# EAGLE design untitled2-6 (EAGLE 9.6.2)
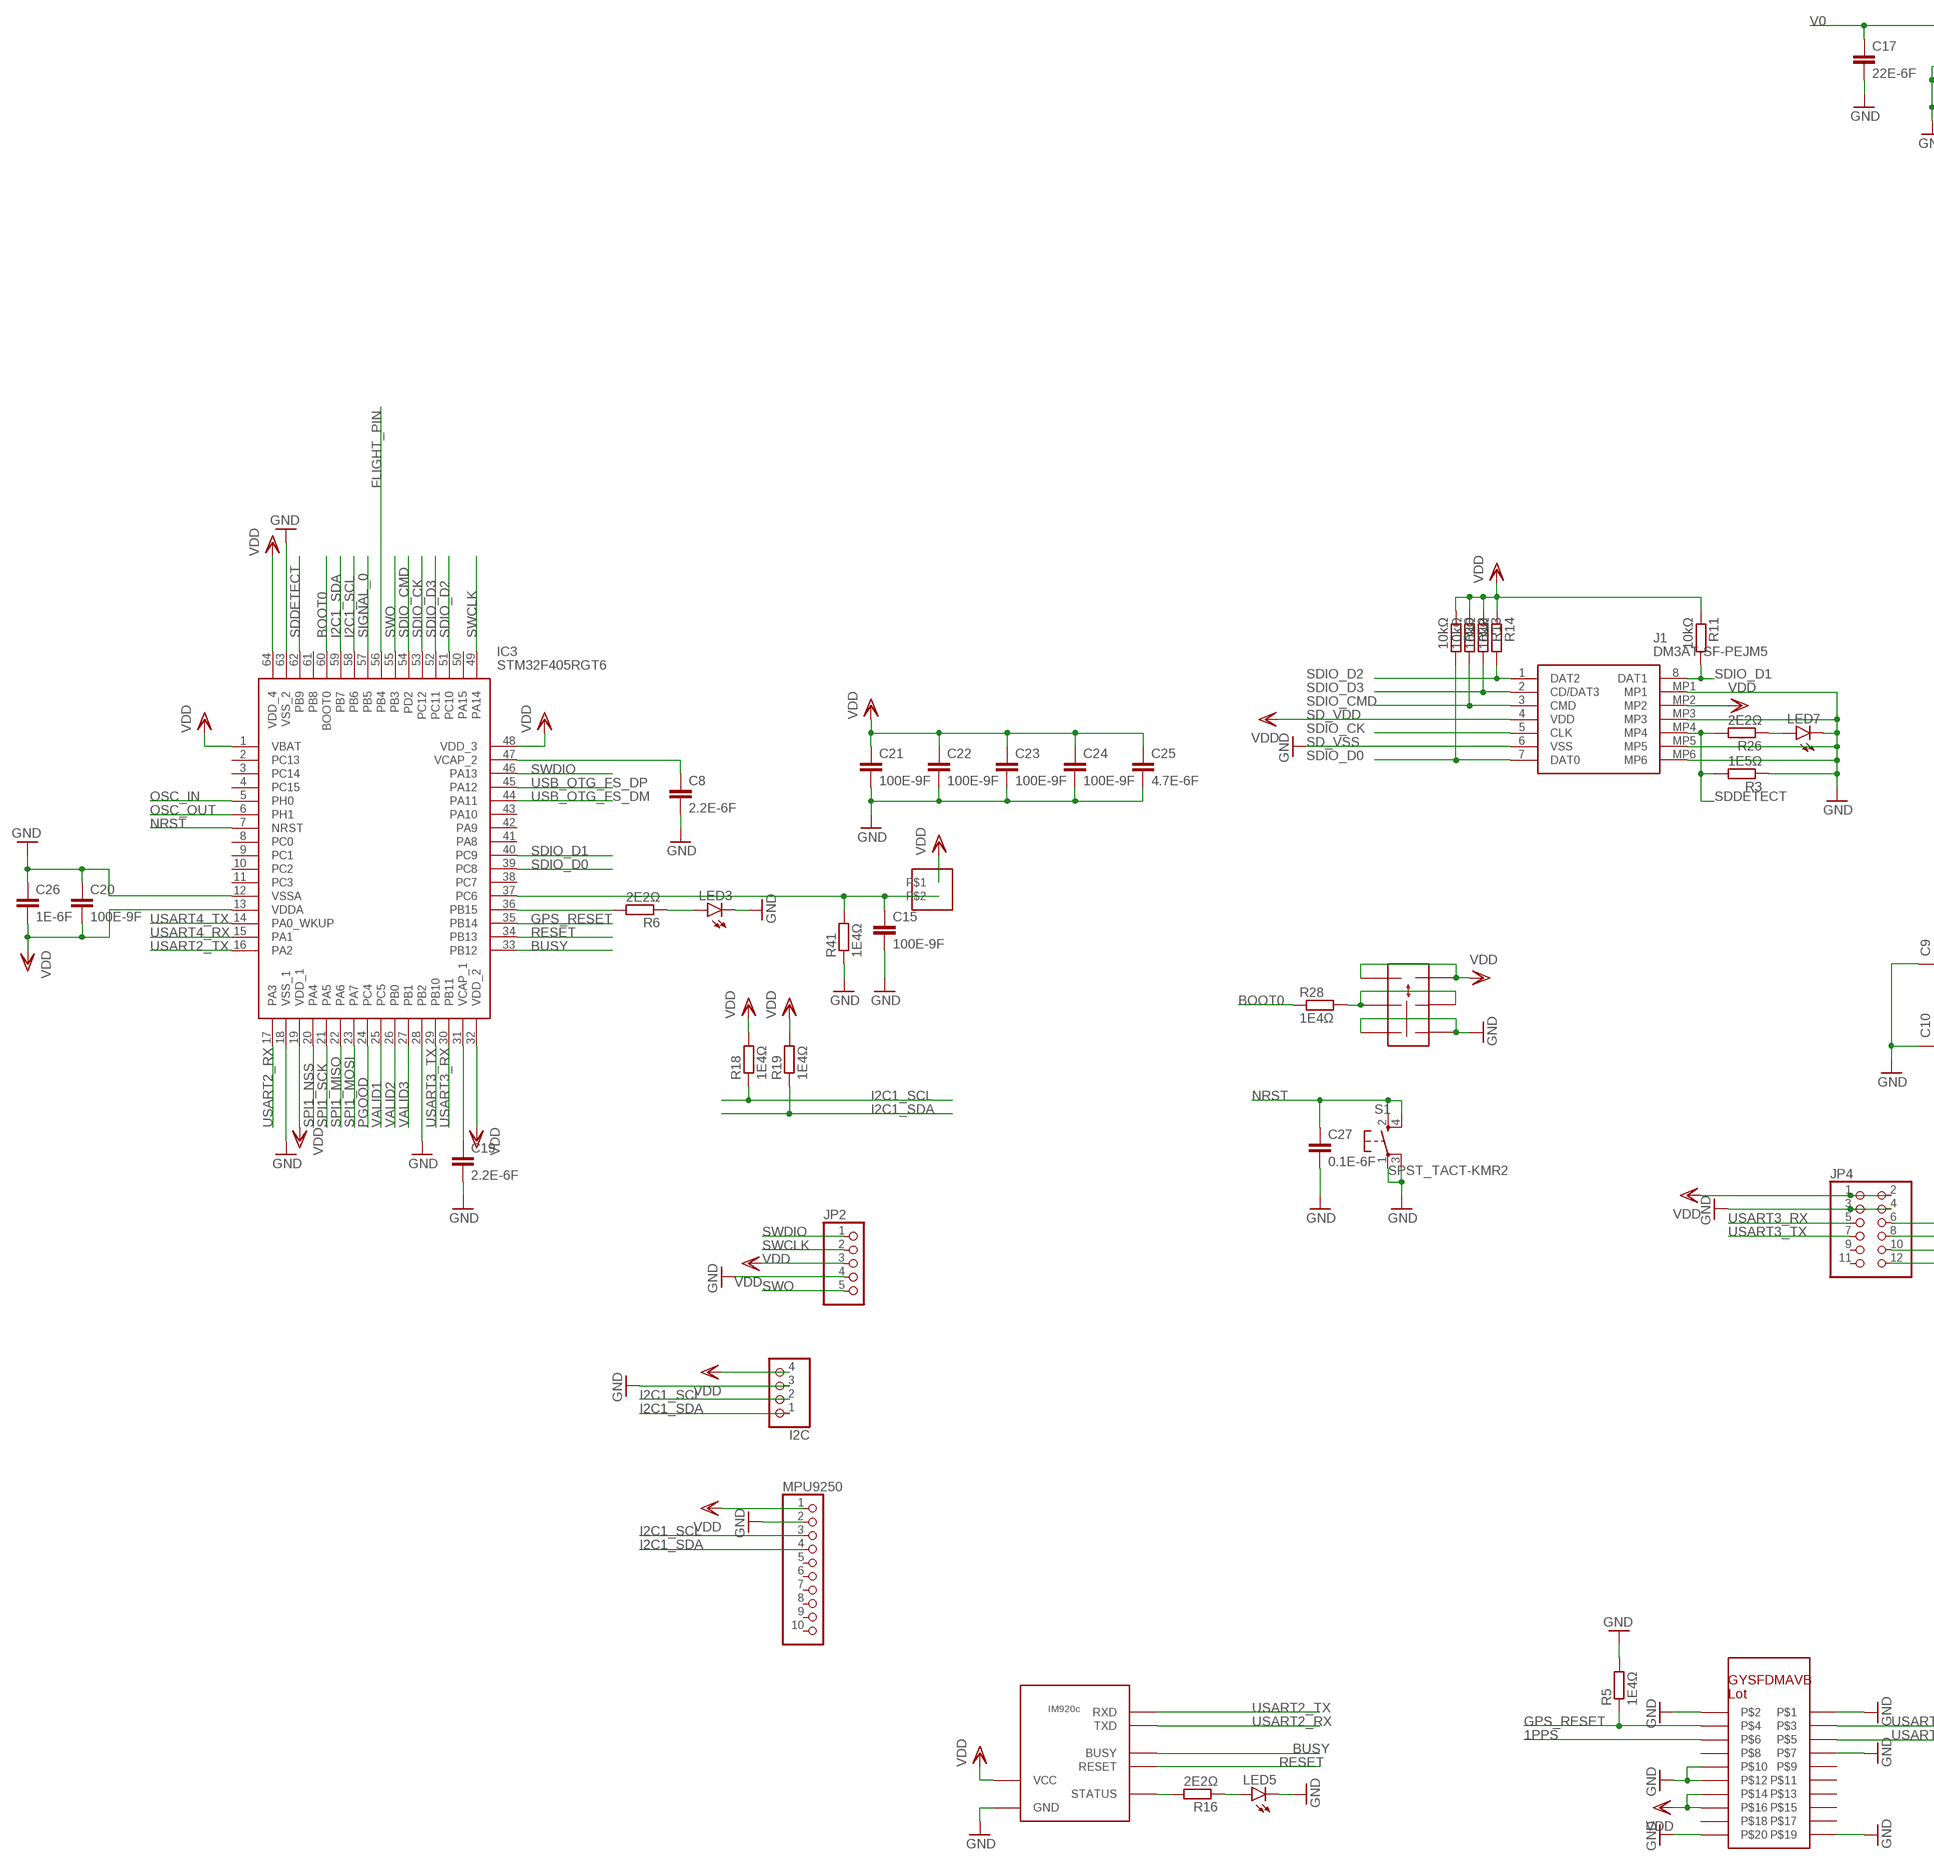
[diagram p0: schematic, sheet 1, part 1 of 2]
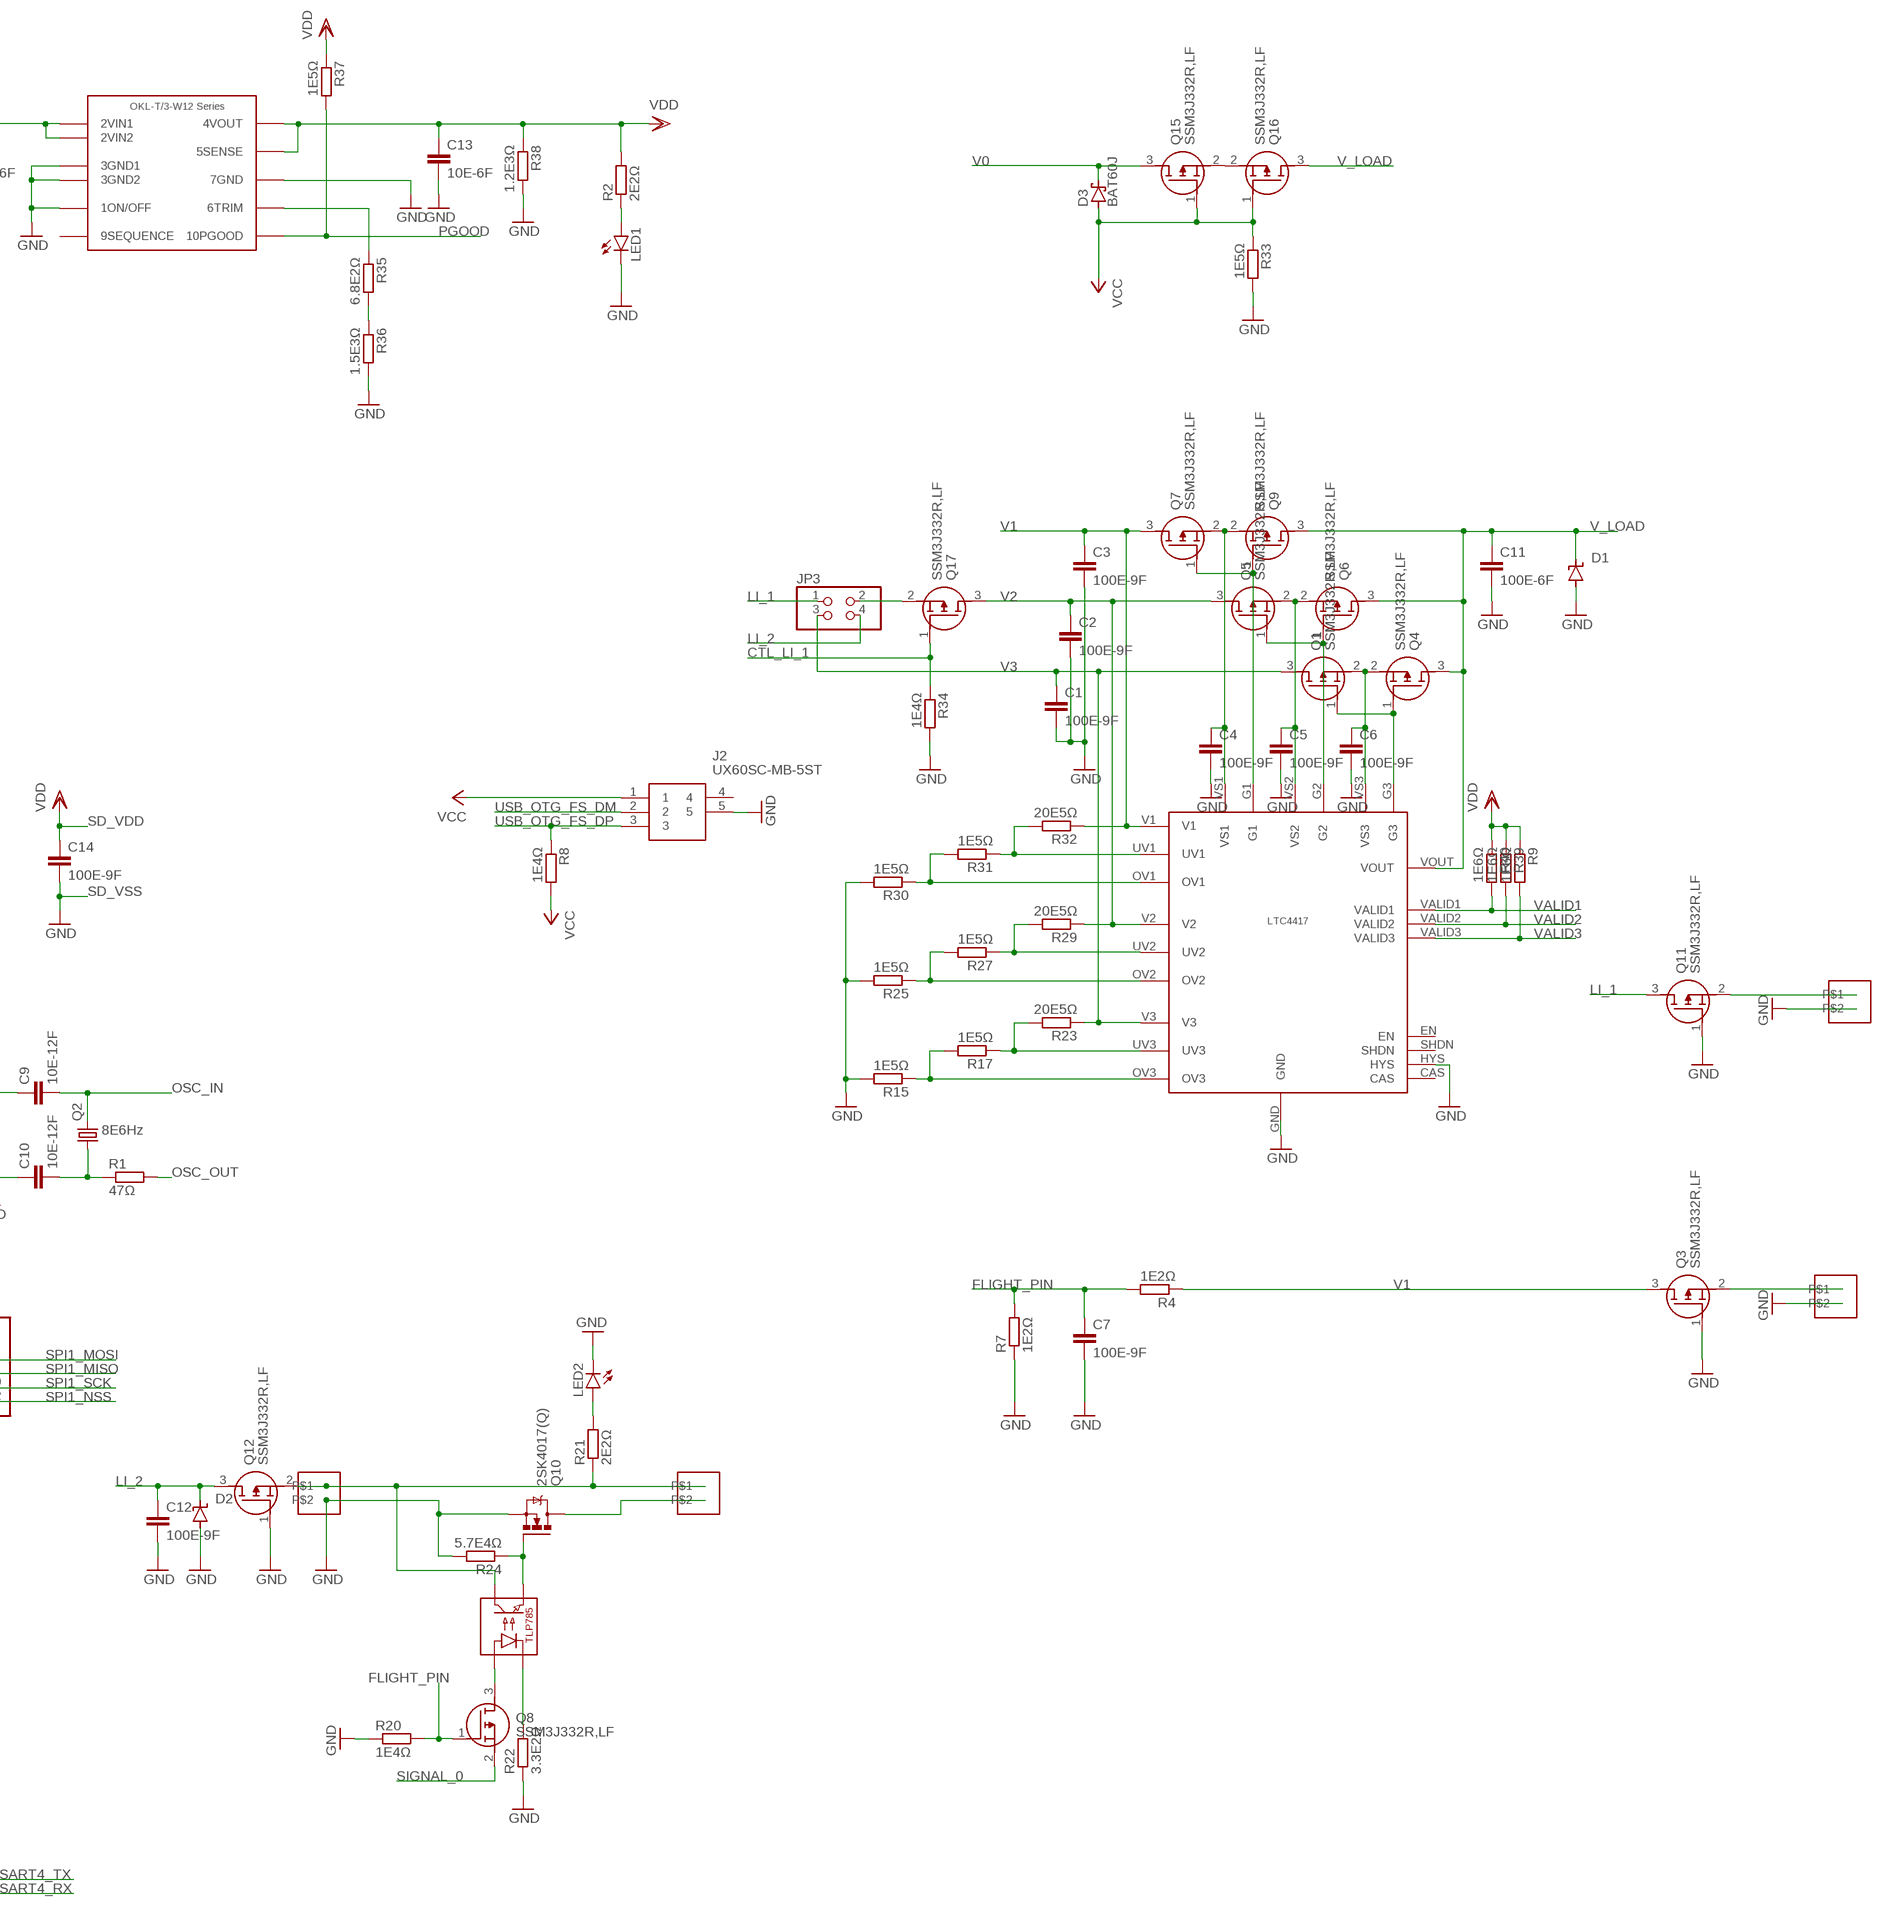
[diagram p1: schematic, sheet 1, part 2 of 2]

## Parts
C1  100E-9F  C-EUC0805  [C0805]
C2  100E-9F  C-EUC0805  [C0805]
C3  100E-9F  C-EUC0805  [C0805]
C4  100E-9F  C-EUC0805  [C0805]
C5  100E-9F  C-EUC0805  [C0805]
C6  100E-9F  C-EUC0805  [C0805]
C7  100E-9F  C-EUC0805  [C0805]
C8  2.2E-6F  C-EUC0805  [C0805]
C9  10E-12F  C-EUC0805  [C0805]
C10  10E-12F  C-EUC0805  [C0805]
C11  100E-6F  C-EUC0805  [C0805]
C12  100E-9F  C-EUC0805  [C0805]
C13  10E-6F  C-EUC0805  [C0805]
C14  100E-9F  C-EUC0805  [C0805]
C15  100E-9F  C-EUC0805  [C0805]
C17  22E-6F  C-EUC0805  [C0805]
C19  2.2E-6F  C-EUC0805  [C0805]
C20  100E-9F  C-EUC0805  [C0805]
C21  100E-9F  C-EUC0805  [C0805]
C22  100E-9F  C-EUC0805  [C0805]
C23  100E-9F  C-EUC0805  [C0805]
C24  100E-9F  C-EUC0805  [C0805]
C25  4.7E-6F  C-EUC0805  [C0805]
C26  1E-6F  C-EUC0805  [C0805]
C27  0.1E-6F  C-EUC0805  [C0805]
D1  SUPPRESSOR-SMBJ  [SMBJ]
D2  SUPPRESSOR-SMBJ  [SMBJ]
D3  BAT60J  [SOD323_ST]
I2C  PINHD-1X4  [1X04]
IC3  STM32F405RGT6  [QFP50P1200X1200X160-64N]
J1  DM3AT-SF-PEJM5  [DM3ATSFPEJM5]
J2  UX60SC-MB-5ST  [UX60SC-MB-5ST]
JP2  PINHD-1X5  [1X05]
JP3  PINHD-2X2  [2X02]
JP4  PINHD-2X6  [2X06]
LED1  LEDCHIP-LED0805  [CHIP-LED0805]
LED2  LEDCHIP-LED0805  [CHIP-LED0805]
LED3  LEDCHIP-LED0805  [CHIP-LED0805]
LED5  LEDCHIP-LED0805  [CHIP-LED0805]
LED7  LEDCHIP-LED0805  [CHIP-LED0805]
MPU9250  PINHD-1X10  [1X10]
Q1  SSM3J332R,LF  [2-3Z1S(SOT-23F)]
Q2  CRYSTALCTS406  [CTS406]
Q3  SSM3J332R,LF  [2-3Z1S(SOT-23F)]
Q4  SSM3J332R,LF  [2-3Z1S(SOT-23F)]
Q5  SSM3J332R,LF  [2-3Z1S(SOT-23F)]
Q6  SSM3J332R,LF  [2-3Z1S(SOT-23F)]
Q7  SSM3J332R,LF  [2-3Z1S(SOT-23F)]
Q8  SSM3J332R,LF  [2-3Z1S(SOT-23F)]
Q9  SSM3J332R,LF  [2-3Z1S(SOT-23F)]
Q10  2SK4017(Q)  [TO230P230X650X740-3P]
Q11  SSM3J332R,LF  [2-3Z1S(SOT-23F)]
Q12  SSM3J332R,LF  [2-3Z1S(SOT-23F)]
Q15  SSM3J332R,LF  [2-3Z1S(SOT-23F)]
Q16  SSM3J332R,LF  [2-3Z1S(SOT-23F)]
Q17  SSM3J332R,LF  [2-3Z1S(SOT-23F)]
R1  47Ω  R-EU_R0603  [R0603]
R2  2E2Ω  R-EU_R0603  [R0603]
R3  1E5Ω  R-EU_R0603  [R0603]
R4  1E2Ω  R-EU_R0603  [R0603]
R5  1E4Ω  R-EU_R0603  [R0603]
R6  2E2Ω  R-EU_R0603  [R0603]
R7  1E2Ω  R-EU_R0603  [R0603]
R8  1E4Ω  R-EU_R0603  [R0603]
R9  1E6Ω  R-EU_R0603  [R0603]
R10  10kΩ  R-EU_R0603  [R0603]
R11  10kΩ  R-EU_R0603  [R0603]
R12  10kΩ  R-EU_R0603  [R0603]
R13  10kΩ  R-EU_R0603  [R0603]
R14  10kΩ  R-EU_R0603  [R0603]
R15  1E5Ω  R-EU_R0603  [R0603]
R16  2E2Ω  R-EU_R0603  [R0603]
R17  1E5Ω  R-EU_R0603  [R0603]
R18  1E4Ω  R-EU_R0603  [R0603]
R19  1E4Ω  R-EU_R0603  [R0603]
R20  1E4Ω  R-EU_R0603  [R0603]
R21  2E2Ω  R-EU_R0603  [R0603]
R22  3.3E2Ω  R-EU_R0603  [R0603]
R23  20E5Ω  R-EU_R0603  [R0603]
R24  5.7E4Ω  R-EU_R0603  [R0603]
R25  1E5Ω  R-EU_R0603  [R0603]
R26  2E2Ω  R-EU_R0603  [R0603]
R27  1E5Ω  R-EU_R0603  [R0603]
R28  1E4Ω  R-EU_R0603  [R0603]
R29  20E5Ω  R-EU_R0603  [R0603]
R30  1E5Ω  R-EU_R0603  [R0603]
R31  1E5Ω  R-EU_R0603  [R0603]
R32  20E5Ω  R-EU_R0603  [R0603]
R33  1E5Ω  R-EU_R0603  [R0603]
R34  1E4Ω  R-EU_R0603  [R0603]
R35  6.8E2Ω  R-EU_R0603  [R0603]
R36  1.5E3Ω  R-EU_R0603  [R0603]
R37  1E5Ω  R-EU_R0603  [R0603]
R38  1.2E3Ω  R-EU_R0603  [R0603]
R39  1E6Ω  R-EU_R0603  [R0603]
R40  1E6Ω  R-EU_R0603  [R0603]
R41  1E4Ω  R-EU_R0603  [R0603]
S1  SPST_TACT-KMR2  [KMR2]
TRANSISTER2  TLP785  [TLP785]
U$1  B2B-XH-A  [B2B-XH-A]
U$2  LTC4417  [LTC4417]
U$3  OKL-T/3-W12SERIES  [OKL-T/3-W12SERIES]
U$4  GYSFDMAXB_LOT  [GYSFDMAXB_LOT]
U$5  IM920C  [IM920C]
U$6  B2B-XH-A  [B2B-XH-A]
U$7  B2B-XH-A  [B2B-XH-A]
U$8  B2B-XH-A  [B2B-XH-A]
U$9  SSSS213202  [SSSS213202]
U$10  B2B-XH-A  [B2B-XH-A]

## Nets
1PPS: U$4.P$6
BOOT0: IC3.60(BOOT0) R28.1
BUSY: IC3.33(PB12) U$5.BUSY
CTL_LI_1: Q17.1(G) R34.1
FLIGHT_PIN: C7.1 IC3.56(PB4) Q8.1(G) R4.2 R7.2 R20.2
GND [VCC]: C1.2 C2.2 C3.2 C4.2 C5.2 C6.2 C7.2 C8.2 C9.1 C10.1 C11.2 C12.2 C13.2 C14.2 C15.2 C17.2 C19.2 C20.1 C21.2 C22.2 C23.2 C24.2 C25.2 C26.1 C27.2 D1.A D2.A I2C.3 IC3.12(VSSA) IC3.18(VSS_1) IC3.28(PB2) IC3.63(VSS_2) J1.6(VSS) J1.MP1 J1.MP3 J1.MP5 J1.MP6 J2.5 JP2.4 JP4.3 JP4.4 LED1.C LED2.C LED3.C LED5.C LED7.C MPU9250.2 Q3.1(G) Q10.3(S) Q11.1(G) Q12.1(G) R3.1 R5.2 R7.1 R15.2 R20.1 R22.1 R24.2 R25.2 R30.2 R33.2 R34.2 R36.2 R38.2 R41.1 S1.1(P) S1.3(P1) U$1.P$2 U$2.GND U$2.HYS U$3.1ON/OFF U$3.3GND1 U$3.3TGND2(3GND2) U$3.7GND U$4.P$1 U$4.P$2 U$4.P$7 U$4.P$10 U$4.P$12 U$4.P$19 U$4.P$20 U$5.GND U$6.P$2 U$8.P$2 U$9.P$5 U$9.P$6
GPS_RESET: IC3.35(PB14) R5.1 U$4.P$4
I2C1_SCL: I2C.2 IC3.58(PB6) MPU9250.3 R18.1
I2C1_SDA: I2C.1 IC3.59(PB7) MPU9250.4 R19.1
LI_1: JP3.1 Q11.3(D)
LI_2: C12.1 D2.C JP3.4 Q12.3(D)
N$1: R16.2 U$5.STATUS
N$2: LED1.A R2.1
N$3: IC3.36(PB15) R6.2
N$4: Q11.2(S) U$1.P$1
N$5 [VCC]: C15.1 IC3.37(PC6) R41.2 U$10.P$2
N$6: R15.1 R17.2 U$2.OV3
N$7: C10.2 Q2.1 R1.1
N$8: LED3.A R6.1
N$9: R17.1 R23.2 U$2.UV3
N$10: Q1.1(G) Q4.1(G) U$2.G3
N$11: R30.1 R31.2 U$2.OV1
N$12: R31.1 R32.2 U$2.UV1
N$13: R28.2 U$9.P$3 U$9.P$4
N$14 [VCC]: Q10.2(D) U$7.P$2
N$15: R27.1 R29.2 U$2.UV2
N$16: R25.1 R27.2 U$2.OV2
N$17: C6.1 Q1.2(S) Q4.2(S) U$2.VS3
N$18 [VIN]: Q3.2(S) U$6.P$1
N$20: Q12.2(S) R21.1 TRANSISTER2.P$3 U$7.P$1 U$8.P$1
N$21: C5.1 Q5.2(S) Q6.2(S) U$2.VS2
N$22: Q5.1(G) Q6.1(G) U$2.G2
N$23: C4.1 Q7.2(S) Q9.2(S) U$2.VS1
N$24: Q7.1(G) Q9.1(G) U$2.G1
N$27: R35.1 U$3.6TRIM
N$28: Q15.2(S) Q16.2(S)
N$31: R35.2 R36.1
N$32: Q8.3(D) TRANSISTER2.P$1
N$35: Q10.1(G) R24.1 TRANSISTER2.P$4
N$36: LED5.A R16.1
N$39: JP3.2 Q17.2(S)
N$41: LED2.A R21.2
N$42: R22.2 TRANSISTER2.P$2
N$43 [VCC]: LED7.A R26.1
N$45 [VCC]: C19.1 IC3.31(VCAP_1)
N$46 [VCC]: C8.1 IC3.47(VCAP_2)
NRST: C27.1 IC3.7(NRST) S1.2(S) S1.4(S1)
OSC_IN: C9.2 IC3.5(PH0) Q2.3
OSC_OUT: IC3.6(PH1) R1.2
PGOOD: IC3.24(PC4) R37.2 U$3.10PGOOD
RESET: IC3.34(PB13) U$5.RESET
SDDETECT: IC3.62(PB9) J1.MP4 R3.2 R26.2
SDIO_CK: IC3.53(PC12) J1.5(CLK)
SDIO_CMD: IC3.54(PD2) J1.3(CMD) R12.2
SDIO_D0: IC3.39(PC8) J1.7(DAT0) R10.2
SDIO_D1: IC3.40(PC9) J1.8(DAT1) R11.2
SDIO_D2: IC3.51(PC10) J1.1(DAT2) R14.2
SDIO_D3: IC3.52(PC11) J1.2(CD/DAT3) R13.2
SIGNAL_0: IC3.57(PB5) Q8.2(S)
SPI1_MISO: IC3.22(PA6) JP4.8
SPI1_MOSI: IC3.23(PA7) JP4.6
SPI1_NSS: IC3.20(PA4) JP4.12
SPI1_SCK: IC3.21(PA5) JP4.10
SWCLK: IC3.49(PA14) JP2.2
SWDIO: IC3.46(PA13) JP2.1
SWO: IC3.55(PB3) JP2.5
USART2_RX: IC3.17(PA3) U$5.TXD
USART2_TX: IC3.16(PA2) U$5.RXD
USART3_RX: IC3.30(PB11) JP4.5
USART3_TX: IC3.29(PB10) JP4.7
USART4_RX: IC3.15(PA1) U$4.P$5
USART4_TX: IC3.14(PA0_WKUP) U$4.P$3
USB_OTG_FS_DM: IC3.44(PA11) J2.2
USB_OTG_FS_DP: IC3.45(PA12) J2.3 R8.1
V0: C17.1 D3.C Q15.3(D) U$3.2VIN1 U$3.2VIN2
V1: C3.1 Q3.3(D) Q7.3(D) R4.1 R32.1 U$2.V1
V2: C2.1 Q5.3(D) Q17.3(D) R29.1 U$2.V2
V3: C1.1 JP3.3 Q1.3(D) R23.1 U$2.V3
V_LOAD: C11.1 D1.C Q4.3(D) Q6.3(D) Q9.3(D) Q16.3(D) U$2.VOUT
VALID1: IC3.25(PC5) R40.2 U$2.VALID1
VALID2: IC3.26(PB0) R39.2 U$2.VALID2
VALID3: IC3.27(PB1) R9.2 U$2.VALID3
VCC [VCC]: D3.A J2.1 Q15.1(G) Q16.1(G) R8.2 R33.1
VDD [VDD]: C13.1 C14.1 C20.2 C21.1 C22.1 C23.1 C24.1 C25.1 C26.2 I2C.4 IC3.1(VBAT) IC3.13(VDDA) IC3.19(VDD_1) IC3.32(VDD_2) IC3.48(VDD_3) IC3.64(VDD_4) J1.4(VDD) J1.MP2 JP2.3 JP4.1 JP4.2 MPU9250.1 R2.2 R9.1 R10.1 R11.1 R12.1 R13.1 R14.1 R18.2 R19.2 R37.1 R38.1 R39.1 R40.1 U$3.4VOUT U$3.5SENSE U$4.P$14 U$4.P$16 U$5.VCC U$9.P$1 U$9.P$2 U$10.P$1
Unconnected: IC3.2(PC13) IC3.3(PC14) IC3.4(PC15) IC3.8(PC0) IC3.9(PC1) IC3.10(PC2) IC3.11(PC3) IC3.38(PC7) IC3.41(PA8) IC3.42(PA9) IC3.43(PA10) IC3.50(PA15) IC3.61(PB8) J2.4 JP4.9 JP4.11 MPU9250.5 MPU9250.6 MPU9250.7 MPU9250.8 MPU9250.9 MPU9250.10 U$2.CAS U$2.EN U$2.SHDN U$3.9SEQUENCE U$4.P$8 U$4.P$9 U$4.P$11 U$4.P$13 U$4.P$15 U$4.P$17 U$4.P$18

## Notes on the sheet
- SD_VDD
- SD_VDD
- SD_VSS
- SD_VSS
- 8E6Hz

## Library data of the parts
C1-C15 C17 C19-C27 = rcl:C-EU: CAPACITOR, European symbol; SPICEPREFIX: C
D1 D2 = diode:SUPPRESSOR-: Suppressor diode
D3 = diode:BAT60J: Schottky barrier diode Source: www.st.com, BAT60J.pdf
I2C = pinhead:PINHD-1X4: PIN HEADER
IC3 = SamacSys_Parts:STM32F405RGT6: MCU 32-Bit, ARM Cortex M4, 1MB Flash STMicroelectronics STM32F405RGT6, 32bit ARM Cortex M4F Microcontroller, 168MHz, 1024 kB Flash, 64-Pin LQFP Source: Datasheet <http://www.st.com/web/en/resource/technical/document/datasheet/DM00037051.pdf>; DESCRIPTION: MCU 32-Bit, ARM Cortex M4, 1MB Flash STMicroelectronics STM32F405RGT6, 32bit ARM Cortex M4F Microcontroller, 168MHz, 1024 kB Flash, 64-Pin LQFP; HEIGHT: 1.6mm; MANUFACTURER_NAME: STMicroelectronics; MANUFACTURER_PART_NUMBER: STM32F405RGT6; MOUSER_PART_NUMBER: 511-STM32F405RGT6; MOUSER_PRICE-STOCK: https://www.mouser.co.uk/ProductDetail/STMicroelectronics/STM32F405RGT6?qs=Z8%252BeY1k3TIKgj7QWsYGpQw%3D%3D
J1 = SamacSys_Parts:DM3AT-SF-PEJM5: Memory Card Connectors R/A SMT MICROSD CON PUSH-PUSH TOP BRDMNT Source: Datasheet <https://datasheet.lcsc.com/szlcsc/Hirose-HRS-DM3AT-SF-PEJM5_C114218.pdf>; DESCRIPTION: Memory Card Connectors R/A SMT MICROSD CON PUSH-PUSH TOP BRDMNT; HEIGHT: 1.83mm; MANUFACTURER_NAME: Hirose; MANUFACTURER_PART_NUMBER: DM3AT-SF-PEJM5; MOUSER_PART_NUMBER: 798-DM3AT-SF-PEJM5; MOUSER_PRICE-STOCK: https://www.mouser.co.uk/ProductDetail/Hirose-Connector/DM3AT-SF-PEJM5/?qs=LZSZKJVF%252B2WTDKp%252BR7IYAQ%3D%3D
J2 = SamacSys_Parts:UX60SC-MB-5ST: Hirose UX60 Series Right Angle SMT Version 2.0 Type B Mini USB Connector Receptacle, 30 V ac, 1A Source: Datasheet; DESCRIPTION: Hirose UX60 Series Right Angle SMT Version 2.0 Type B Mini USB Connector Receptacle, 30 V ac, 1A; HEIGHT: mm; MANUFACTURER_NAME: Hirose; MANUFACTURER_PART_NUMBER: UX60SC-MB-5ST; MOUSER_PART_NUMBER: 798-UX60SC-MB-5ST; MOUSER_PRICE-STOCK: https://www.mouser.co.uk/ProductDetail/Hirose-Connector/UX60SC-MB-5ST?qs=XQjbzJWzFPVAXBHee%2FyNFw%3D%3D
JP2 = pinhead:PINHD-1X5: PIN HEADER
JP3 = pinhead:PINHD-2X2: PIN HEADER
JP4 = pinhead:PINHD-2X6: PIN HEADER
LED1-LED3 LED5 LED7 = led:LED: LED OSRAM: - CHIPLED LG R971, LG N971, LY N971, LG Q971, LY Q971, LO R971, LY R971 LH N974, LH R974 LS Q976, LO Q976, LY Q976 LO Q996 - Hyper CHIPLED LW Q18S LB Q993, LB Q99A, LB R99A - SideLED LS A670, LO A670, LY A670, LG A670, LP A670 LB A673, LV A673, LT A673, LW A673 LH A674 LY A675 LS A676, LA A676, LO A676, LY A676, LW A676 LS A679, LY A679, LG A679 - Hyper Micro SIDELED® LS Y876, LA Y876, LO Y876, LY Y876 LT Y87S - SmartLED LW L88C, LW L88S LB L89C, LB L89S, LG L890 LS L89K, LO L89K, LY L89K LS L896, LA L896, LO L896, LY L896 - TOPLED LS T670, LO T670, LY T670, LG T670, LP T670 LSG T670, LSP T670, LSY T670, LOP T670, LYG T670 LG T671, LOG T671, LSG T671 LB T673, LV T673, LT T673, LW T673 LH T674 LS T676, LA T676, LO T676, LY T676, LB T676, LH T676, LSB T676, LW T676 LB T67C, LV T67C, LT T67C, LS T67K, LO T67K, LY T67K, LW E67C LS E67B, LA E67B, LO E67B, LY E67B, LB E67C, LV E67C, LT E67C LW T67C LS T679, LY T679, LG T679 LS T770, LO T770, LY T770, LG T770, LP T770 LB T773, LV T773, LT T773, LW T773 LH T774 LS E675, LA E675, LY E675, LS T675 LS T776, LA T776, LO T776, LY T776, LB T776 LHGB T686 LT T68C, LB T68C - Hyper Mini TOPLED® LB M676 - Mini TOPLED Santana® LG M470 LS M47K, LO M47K, LY M47K Source: http://www.osram.convergy.de LUXEON: - LUMILED® LXK2-PW12-R00, LXK2-PW12-S00, LXK2-PW14-U00, LXK2-PW14-V00 LXK2-PM12-R00, LXK2-PM12-S00, LXK2-PM14-U00 LXK2-PE12-Q00, LXK2-PE12-R00, LXK2-PE12-S00, LXK2-PE14-T00, LXK2-PE14-U00 LXK2-PB12-K00, LXK2-PB12-L00, LXK2-PB12-M00, LXK2-PB14-N00, LXK2-PB14-P00, LXK2-PB14-Q00 LXK2-PR12-L00, LXK2-PR12-M00, LXK2-PR14-Q00, LXK2-PR14-R00 LXK2-PD12-Q00, LXK2-PD12-R00, LXK2-PD12-S00 LXK2-PH12-R00, LXK2-PH12-S00 LXK2-PL12-P00, LXK2-PL12-Q00, LXK2-PL12-R00 Source: www.luxeon.com KINGBRIGHT: KA-3528ASYC Source: www.kingbright.com
MPU9250 = pinhead:PINHD-1X10: PIN HEADER
Q1 Q3-Q9 Q11 Q12 Q15-Q17 = SamacSys_Parts:SSM3J332R,LF: MOSFET SM Sig P-CH MOS 12V VGSS -6A -30VDSS Source: Datasheet; DESCRIPTION: MOSFET SM Sig P-CH MOS 12V VGSS -6A -30VDSS; HEIGHT: mm; MANUFACTURER_NAME: Toshiba; MANUFACTURER_PART_NUMBER: SSM3J332R,LF; MOUSER_PART_NUMBER: 757-SSM3J332RLF; MOUSER_PRICE-STOCK: https://www.mouser.co.uk/ProductDetail/Toshiba/SSM3J332RLF?qs=%252B8yZ8wZTKG5UW86maIHWeg%3D%3D
Q2 = crystal:CRYSTAL: CRYSTAL; OC_FARNELL: unknown; OC_NEWARK: unknown
Q10 = 2SK4017_Q_:2SK4017(Q): Trans MOSFET N-CH 60V 5A 3-Pin(3+Tab) PW-Mold2 Check prices <https://pricing.snapeda.com/parts/2SK4017%28Q%29/Toshiba%20Semiconductor/view-part?ref=eda>; AVAILABILITY: Warning; DESCRIPTION: N-Channel 60V 5A (Ta) 20W (Tc) Through Hole PW-MOLD2; MF: Toshiba Semiconductor; MP: 2SK4017(Q); PACKAGE: TO-251 Toshiba; PRICE: None
R1-R41 = rcl:R-EU_: RESISTOR, European symbol; SPICEPREFIX: R
S1 = adafruit:SPST_TACT: SMT 6mm switch, EVQQ2 series http://www.ladyada.net/library/eagle
TRANSISTER2 = untitled:TLP785
U$1 U$6-U$8 U$10 = untitled:B2B-XH-A
U$2 = untitled:LTC4417
U$3 = untitled:OKL-T/3-W12SERIES
U$4 = untitled:GYSFDMAXB_LOT
U$5 = untitled:IM920C
U$9 = untitled:SSSS213202

## Net classes
1 supply: width 0.15 mm
2 VDD: width 0.254 mm
3 VCC: width 0.305 mm
4 VIN: width 0.61 mm

## Board
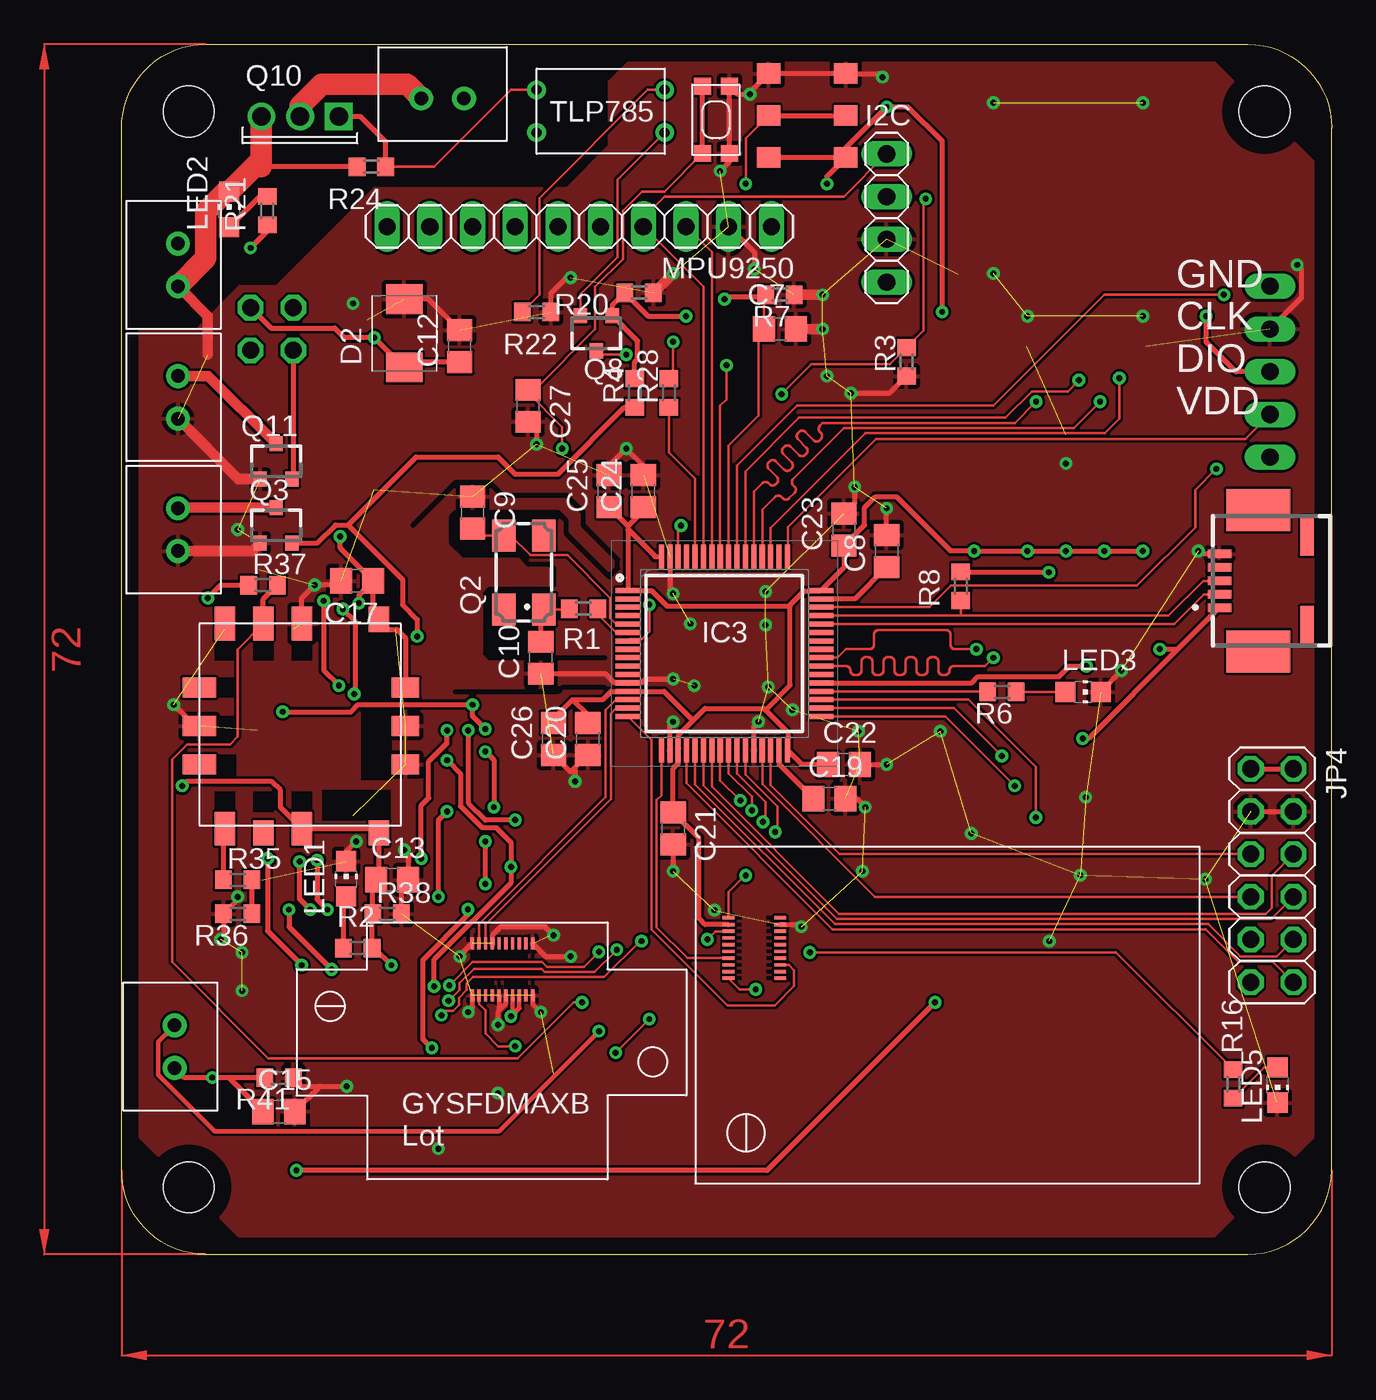
[diagram p2: board, top side]
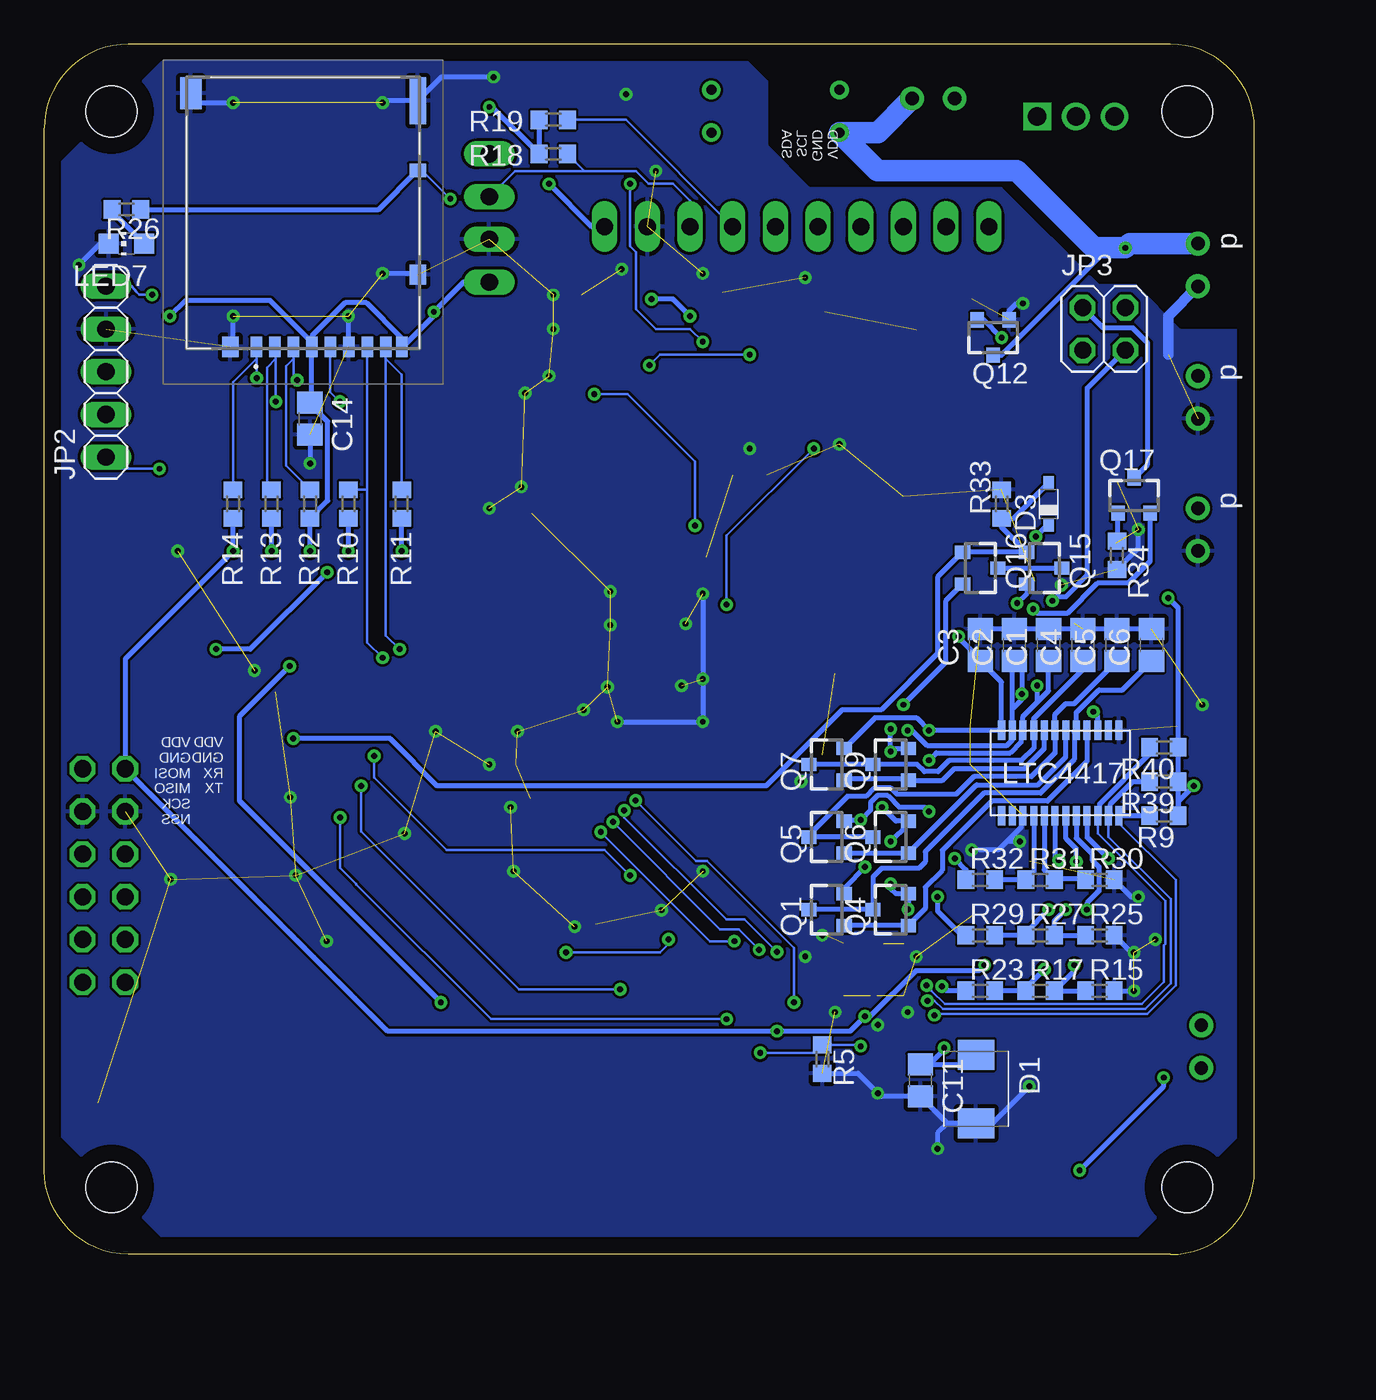
[diagram p3: board, bottom side, seen from below]

Size 72 x 72 mm. Coordinates in mm from the lower left corner, seen from the top.
Outline: 5,0 67,0 arc89 72,5 72,67 arc90 67,72 5,72 arc90 0,67 0,5 arc90 5,0
Copper layers (1*16): Top 0.035mm / dielectric 1.5mm / Bottom 0.035mm
Design rules "default": minimum track width 6mil, minimum drill 0.35mm, track to track 6mil, track to pad 6mil, pad to pad 6mil, via to via 6mil, smd to smd 6mil, copper to edge 40mil, drill to drill 6mil, minimum pad ring 10mil, minimum via ring 8mil, stop-mask expansion 4mil, vias tented up to drill 0mil, thermal gap 10mil
Holes 3 mm at 68,68 68,4 4,4 4,68
tRestrict: 36 lines

### Footprints (pad centres in the part's own frame; a part is rotated, then mirrored left to right if it is on the bottom)
C0805 = smd 1.3 x 1.5: 1 -0.95,0; 2 0.95,0
SMBJ = smd 1.78 x 2.16: A 2.04,0; C -2.03,0
SOD323_ST = smd 0.8 x 0.6: A 1.25,0; C -1.25,0
1X04 = drill 1.016 long: 1 -3.81,0; 2 -1.27,0; 3 1.27,0; 4 3.81,0
QFP50P1200X1200X160-64N = smd 1.475 x 0.3: 1 -5.738,3.75; 2 -5.738,3.25; 3 -5.738,2.75; 4 -5.738,2.25; 5 -5.738,1.75; 6 -5.738,1.25; 7 -5.738,0.75; 8 -5.738,0.25; 9 -5.738,-0.25; 10 -5.738,-0.75; 11 -5.738,-1.25; 12 -5.738,-1.75; 13 -5.738,-2.25; 14 -5.738,-2.75; 15 -5.738,-3.25; 16 -5.738,-3.75; 33 5.738,-3.75; 34 5.738,-3.25; 35 5.738,-2.75; 36 5.738,-2.25; 37 5.738,-1.75; 38 5.738,-1.25; 39 5.738,-0.75; 40 5.738,-0.25; 41 5.738,0.25; 42 5.738,0.75; 43 5.738,1.25; 44 5.738,1.75; 45 5.738,2.25; 46 5.738,2.75; 47 5.738,3.25; 48 5.738,3.75 | smd 0.3 x 1.475: 17 -3.75,-5.738; 18 -3.25,-5.738; 19 -2.75,-5.738; 20 -2.25,-5.738; 21 -1.75,-5.738; 22 -1.25,-5.738; 23 -0.75,-5.738; 24 -0.25,-5.738; 25 0.25,-5.738; 26 0.75,-5.738; 27 1.25,-5.738; 28 1.75,-5.738; 29 2.25,-5.738; 30 2.75,-5.738; 31 3.25,-5.738; 32 3.75,-5.738; 49 3.75,5.738; 50 3.25,5.738; 51 2.75,5.738; 52 2.25,5.738; 53 1.75,5.738; 54 1.25,5.738; 55 0.75,5.738; 56 0.25,5.738; 57 -0.25,5.738; 58 -0.75,5.738; 59 -1.25,5.738; 60 -1.75,5.738; 61 -2.25,5.738; 62 -2.75,5.738; 63 -3.25,5.738; 64 -3.75,5.738
DM3ATSFPEJM5 = smd 0.7 x 1.2: 1 2.775,7.412; 2 1.675,7.412; 3 0.575,7.412; 4 -0.525,7.412; 5 -1.625,7.412; 6 -2.725,7.412; 7 -3.825,7.412; 8 -4.925,7.412; MP2 -5.875,7.412 | smd 1 x 1.2: MP1 4.325,7.412; MP3 -6.825,3.112 | smd 1 x 0.8: MP4 -6.825,-3.087 | smd 1 x 2.8: MP5 -6.825,-7.237 | smd 1.3 x 1.9: MP6 6.675,-7.688
UX60SC-MB-5ST = smd 0.5 x 1.4: 1 -1.6,5.2; 2 -0.8,5.2; 3 0,5.2; 4 0.8,5.2; 5 1.6,5.2 | smd 2.5 x 3.8: 6 -4.2,2.9; 7 4.2,2.9 | smd 2.35 x 0.8: 8 -2.675,0; 9 2.675,0
1X05 = drill 1.016 long: 1 -5.08,0; 2 -2.54,0; 3 0,0; 4 2.54,0; 5 5.08,0
2X02 = drill 1.016 octagon: 1 -1.27,-1.27; 2 -1.27,1.27; 3 1.27,-1.27; 4 1.27,1.27
2X06 = drill 1.016 octagon: 1 -6.35,-1.27; 2 -6.35,1.27; 3 -3.81,-1.27; 4 -3.81,1.27; 5 -1.27,-1.27; 6 -1.27,1.27; 7 1.27,-1.27; 8 1.27,1.27; 9 3.81,-1.27; 10 3.81,1.27; 11 6.35,-1.27; 12 6.35,1.27
CHIP-LED0805 = smd 1.2 x 1.2: A 0,-1.05; C 0,1.05
1X10 = drill 1.016 long: 1 -11.43,0; 2 -8.89,0; 3 -6.35,0; 4 -3.81,0; 5 -1.27,0; 6 1.27,0; 7 3.81,0; 8 6.35,0; 9 8.89,0; 10 11.43,0
2-3Z1S(SOT-23F) = smd 0.8 x 0.9: 1 -0.95,-1.05; 2 0,1.05; 3 0.95,-1.05
CTS406 = smd 1.9 x 1.4: 1 -2.2,-1.2; 2 2.2,-1.2; 3 2.2,1.2; 4 -2.2,1.2
TO230P230X650X740-3P = drill 1.1 square: 1 0,2.3 | drill 1.1: 2 0,0; 3 0,-2.3
R0603 = smd 1 x 1.1: 1 -0.85,0; 2 0.85,0
KMR2 = smd 1 x 1: 1 2,0.8; 2 2,-0.8; 3 -2,0.8; 4 -2,-0.8
TLP785 = drill 0.6: P$1 -3.81,1.27; P$2 -3.81,-1.27; P$3 3.81,1.27; P$4 3.81,-1.27
B2B-XH-A = drill 0.8 pad 1.422: P$1 0,0; P$2 2.54,0
LTC4417 = smd 0.419 x 1.143: CAS 2.54,2.54; EN -3.81,-2.54; G1 -1.27,2.54; G2 0,2.54; G3 1.27,2.54; GND 3.175,2.54; HYS -2.54,-2.54; OV1 -1.27,-2.54; OV2 0,-2.54; OV3 1.27,-2.54; SHDN -3.175,-2.54; UV1 -1.905,-2.54; UV2 -0.635,-2.54; UV3 0.635,-2.54; V1 -3.81,2.54; V2 -3.175,2.54; V3 -2.54,2.54; VALID1 1.905,-2.54; VALID2 2.54,-2.54; VALID3 3.175,-2.54; VOUT 1.905,2.54; VS1 -1.905,2.54; VS2 -0.635,2.54; VS3 0.635,2.54
OKL-T/3-W12SERIES = smd 2 x 1.2: 1ON/OFF 0,6.1; 5SENSE 12.2,6.1; 6TRIM 12.2,1.52; 9SEQUENCE 0,1.52; 10PGOOD 0,3.81 | smd 1.5 x 1.2: 2VIN1 -0.25,10.68; 4VOUT 12.45,10.68; P$10 12.45,3.81 | smd 1.2 x 1.63: 2VIN2 3.81,12.27; 3GND1 6.1,12.27; 3TGND2 8.39,12.27 | smd 1.2 x 2: 7GND 6.1,0; P$6 3.81,0; P$8 8.39,0
GYSFDMAXB_LOT = smd 0.2 x 0.7: P$1 -1.8,1.54; P$2 -1.8,-1.54; P$3 -1.4,1.54; P$4 -1.4,-1.54; P$5 -1,1.54; P$6 -1,-1.54; P$7 -0.6,1.54; P$8 -0.6,-1.54; P$9 -0.2,1.54; P$10 -0.2,-1.54; P$11 0.2,1.54; P$12 0.2,-1.54; P$13 0.6,1.54; P$14 0.6,-1.54; P$15 1,1.54; P$16 1,-1.54; P$17 1.4,1.54; P$18 1.4,-1.54; P$19 1.8,1.54; P$20 1.8,-1.54
IM920C = smd 0.2 x 0.7: BUSY -1.8,1.54; GND 1.4,-1.54; P$2 -1.8,-1.54; P$3 -1.4,1.54; P$4 -1.4,-1.54; P$5 -1,1.54; P$8 -0.6,-1.54; P$9 -0.2,1.54; P$10 -0.2,-1.54; P$11 0.2,1.54; P$12 0.2,-1.54; P$13 0.6,1.54; P$14 0.6,-1.54; P$20 1.8,-1.54; REG 1,-1.54; RESET 1.8,1.54; RXD -1,-1.54; STATUS 1,1.54; TXD -0.6,1.54; VCC 1.4,1.54
SSSS213202 = smd 1.2 x 1.4: P$1 -2.5,2.2; P$2 -2.5,-2.4; P$3 0,2.2; P$4 0,-2.4; P$5 2.5,2.2; P$6 2.5,-2.4

### Placement (x,y rotation side)
C1  12.25,36.26 90 bottom
C2  14.28,36.26 90 bottom
C3  16.31,36.26 90 bottom
C4  10.21,36.26 90 bottom
C5  8.18,36.26 90 bottom
C6  6.12,36.26 90 bottom
C7  39.17,55.06 0 top
C8  45.52,41.85 90 top
C9  20.88,44.14 270 top
C10  24.95,35.5 90 top
C11  19.87,10.35 270 bottom
C12  20.12,54.04 90 top
C13  16.11,22.29 0 top
C14  56.19,49.72 270 bottom
C15  9.36,8.5 0 top
C17  14.02,40.07 180 top
C19  42.12,27.12 0 top
C20  27.74,30.67 90 top
C21  32.82,25.34 270 top
C22  42.98,29.15 0 top
C23  42.98,43.12 90 top
C24  31.04,45.41 90 top
C25  29.01,45.41 90 top
C26  25.71,30.67 90 top
C27  24.18,50.49 270 top
D1  16.56,9.85 270 bottom
D2  16.82,54.8 90 top
D3  12.25,44.64 90 bottom
I2C  45.52,61.66 270 top
IC3  35.87,35.75 0 top
J1  56.6,61.41 180 bottom
J2  70.52,40.07 90 top
JP2  68.33,52.52 90 bottom
JP3  8.94,55.06 0 bottom
JP4  68.45,22.55 270 top
LED1  13.36,22.34 0 top
LED2  6.4,62.17 0 top
LED3  57.2,33.47 270 top
LED5  68.77,10.08 180 top
LED7  67.11,60.14 90 bottom
MPU9250  27.23,61.15 180 top
Q1  25.45,20.51 90 bottom
Q2  23.93,40.58 90 top
Q3  9.2,43.37 0 top
Q4  21.64,20.51 90 bottom
Q5  25.45,24.83 90 bottom
Q6  21.64,24.83 90 bottom
Q7  25.45,29.15 90 bottom
Q8  28.25,54.8 180 top
Q9  21.64,29.15 90 bottom
Q10  10.62,67.71 270 top
Q11  9.2,47.18 0 top
Q12  15.55,54.55 180 bottom
Q15  12.5,40.83 270 bottom
Q16  16.31,40.83 270 bottom
Q17  7.17,45.15 0 bottom
R1  27.49,38.42 0 top
R2  14.05,18.23 0 top
R3  46.7,53.11 90 top
R4  30.53,51.25 90 top
R5  25.71,11.62 270 bottom
R6  52.38,33.47 180 top
R7  39.17,57.09 180 top
R8  49.93,39.76 90 top
R9  5.39,26.1 180 bottom
R10  53.9,44.64 90 bottom
R11  50.73,44.64 90 bottom
R12  56.19,44.64 90 bottom
R13  58.47,44.64 90 bottom
R14  60.76,44.64 90 bottom
R15  9.2,15.69 0 bottom
R16  66.14,10.15 90 top
R17  12.75,15.69 0 bottom
R18  41.71,65.47 180 bottom
R19  41.71,67.5 180 bottom
R20  30.79,57.22 180 top
R21  8.66,62.09 90 top
R22  24.69,56.07 180 top
R23  16.31,15.69 0 bottom
R24  14.86,64.71 180 top
R25  9.2,18.99 0 bottom
R26  67.11,62.17 0 bottom
R27  12.75,18.99 0 bottom
R28  32.57,51.25 90 top
R29  16.31,18.99 0 bottom
R30  9.2,22.29 0 bottom
R31  12.75,22.29 0 bottom
R32  16.31,22.29 0 bottom
R33  15.04,44.64 90 bottom
R34  8.18,41.6 270 bottom
R35  6.91,22.29 0 top
R36  6.91,20.26 180 top
R37  8.42,39.82 0 top
R38  15.8,20.26 0 top
R39  5.39,28.13 180 bottom
R40  5.39,30.17 180 bottom
R41  9.37,10.52 180 top
S1  35.36,67.5 270 top
TRANSISTER2  28.5,68.01 180 top
U$1  3.36,52.26 270 top
U$2  11.23,28.64 0 bottom
U$3  4.63,37.53 270 top
U$4  22.66,16.96 0 top
U$5  37.65,18.23 90 top
U$6  3.36,44.39 270 top
U$7  20.37,68.77 180 top
U$8  3.36,60.14 270 top
U$9  40.69,67.76 90 top
U$10  3.16,13.64 270 top

### Tracks (layer width: path | path; a pad name or v marks a point on that pad's centre or on a via)
BOOT0
  Top 0.152: IC3.60 34.12,46.15 32.57,47.7 R28.1
BUSY  (via drill 0.35)
  Top 0.152: v53.14,27.88 49.02,32 IC3.33 | v37.73,15.77 36.76,15.77 U$5.BUSY
  Bottom 0.152: v53.14,27.88 53.14,25.15 43.76,15.77 v37.73,15.77
CTL_LI_1
  Bottom 0.305: R34.1 8.12,42.51 Q17.1
FLIGHT_PIN  (via drill 0.35)
  Top 0.152: IC3.56 36.12,48.11 37.9,49.89 37.9,54.74 C7.1 38.22,56.99 R7.2
  Top 0.305: v35.87,56.84 36.02,56.99 38.22,56.99 | v33.58,55.82 31.34,55.82 R20.2 29.2,56.48 Q8.1 30.71,54.34 30.71,53.25 30.53,53.08 R4.2
  Top 0.61: R7.2 38.23,57
  Bottom 0.305: v33.58,55.82 34.6,56.84 v35.87,56.84
GND  (via drill 0.35)  (68 unrouted)
  Top 0.305: IC3.18 32.62,31.49 v32.82,31.69 | IC3.12 30.17,34.05 | 30.17,34.05 30.99,34.05 31.17,34.23 v32.82,34.23 | IC3.28 37.62,31.41 v37.9,31.69 | IC3.63 32.62,39.51 v32.82,39.31 | C22.2 v45.52,29.15 | C19.2 43.74,27.12 v44.25,26.61 | C25.2 29.01,46.93 v30.03,47.95 31.04,46.93 C24.2 | C21.2 v32.82,22.8 | v43.62,45.66 43.62,44.7 C23.2 | C8.2 v45.52,44.39 | v64.06,41.85 64.24,41.67 J2.5 | v26.72,58.11 26.47,58.11 25.54,57.18 R22.1 | R3.1 45.69,51.25 v43.39,51.25 | LED3.C 59.49,34.7 v59.49,34.74 | 30.17,34.05 29.27,34.05 28.77,34.55 C10.1 | v69.94,58.87 70.19,58.61 70.19,56.92 JP2.4 | 25.49,18.99 v25.71,18.99 25.2,19.5 22.55,19.5 22.06,19.01 U$4.P$7 | U$3.1ON/OFF 10.73,39.06 v11.48,39.81 v11.48,39.82 12.82,39.82 C17.2 | C26.1 26.72,28.71 26.98,28.96 | C20.1 26.98,28.96 | 26.98,28.96 v26.98,28.13 | v40.44,19.5 40.31,19.63 U$5.GND | R38.2 16.65,21.89 C13.2 17.06,23.83 v16.82,24.07 | LED1.C 13.36,23.97 v13.96,24.57 | JP4.3 JP4.4 | U$3.7GND 4.38,31.43 v3.1,32.71 | R24.2 8.32,64.71 | C12.2 18.27,56.84 D2.A | v45.27,70.04 45.05,70.26 U$9.P$6 U$9.P$5 37.39,69.16 v37.39,69.03 36.64,69.03 S1.3 S1.1 36.16,65 v35.61,64.46 | MPU9250.2 37.65,59.63 v37.65,58.61 | C27.2 24.69,49.03 v24.69,48.2 | 22.46,14.51 22.41,14.46 v22.41,13.66 | v20.12,17.72 20.12,17.76 U$4.P$1 | v5.9,18.74 6.06,18.9 R36.2 6.91,21.11 v6.91,21.28 | U$4.P$19 25.24,17.72 v26.72,17.72 | U$4.P$10 22.46,14.51 | U$4.P$12 22.86,14.91 22.46,14.51 | U$4.P$20 24.46,14.9 v24.95,14.42 | U$4.P$2 20.86,14.65 v20.63,14.42 | R41.1 10.74,10 v13.4,10 11.81,10 C15.2
  Top 0.61: v41.71,55.06 C7.2 | v32.82,58.36 31.68,57.22 R20.1 | v41.71,57.09 R7.1 | Q3.1 7.77,41.85 U$6.P$2 | Q11.1 6.95,46.13 U$1.P$2 | U$8.P$2 5.13,55.82 5.13,53.53
  Top 1.27: 8.28,67.71 Q10.3 8.32,65.14 | 8.32,65.14 LED2.C 6.19,63.22 5.02,62.05 5.02,59.26 U$8.P$2 | 8.32,65.14 8.32,64.71
  Bottom 0.305: v37.9,31.69 v32.82,31.69 v32.82,34.23 v32.82,39.31 | C14.2 v56.19,47.06 | J1.6 53.87,55.79 v53.9,55.82 | J1.MP3 49.84,58.36 v51.87,58.36 | v51.87,68.52 51.74,68.64 J1.MP5 48.38,70.04 v45.27,70.04 | J1.MP6 62.7,68.52 v60.76,68.52 | J1.MP1 60.76,54.16 v60.76,55.82 | v69.94,58.87 68.67,60.14 LED7.C | C6.2 C5.2 C4.2 C1.2 C2.2 C3.2 | U$2.HYS 13.89,25.98 13.89,25.4 14.73,24.57 | 14.73,24.57 15.23,24.07 v16.82,24.07 | v13.96,24.57 14.73,24.57 | 18.27,7.81 D1.A 15.59,7.81 v13.4,10 | 18.27,7.81 C11.2 22.22,9.4 v22.41,9.59 23.59,10.77 R5.2 | 18.27,7.81 18.85,7.22 v18.85,6.29 | v13.77,56.58 14.12,56.58 14.6,56.11 Q12.1 | R34.2 6.91,42.02 v6.91,43.12 | R25.2 7.33,17.97 v7.17,17.97 | R15.2 v7.17,15.69 | R30.2 7.33,21.28 v6.91,21.28
  Bottom 0.61: U$8.P$2 5.13,55.82 5.13,53.53
  other vias: 41.96,52.26 35.28,20.48 55.2,18.64 44.08,22.8 57.04,22.56 64.48,22.32 50.56,25.04 57.36,27.2 48.72,31.12 43.84,31.12 33.84,37.52 38.32,37.44 38.48,33.76 34.08,33.84 38.32,39.44 39.92,32.4
  pour Top: -0.2,55.02 4.4,55 7,57.6 9.2,57.6 15.04,63.44 26.47,63.44 29.01,65.98 29.01,69.79 31.55,72.33 63.65,72.33 72.19,63.79 72.19,8.21 63.92,-0.06 8.08,-0.06 -0.2,8.22
  pour Bottom: -0.21,8.22 -0.25,55 4.4,55 7.06,57.66 9.26,57.66 15.04,63.44 26.47,63.44 29.01,65.98 29.01,69.79 31.55,72.33 63.65,72.33 72.19,63.79 72.19,8.22 63.91,-0.06 8.07,-0.06
GPS_RESET  (via drill 0.35)
  Top 0.152: U$4.P$4 21.26,14.91 21.64,14.53 21.64,13.15 22.41,12.39 v23.42,12.39 | IC3.35 50.4,33 54.4,29 v54.4,26 | v31.4,14 v29.4,12
  Bottom 0.152: v23.42,12.39 23.51,12.47 R5.1 26.18,12 v29.4,12 | v54.4,26 54.4,23 53.45,22.05 53.45,22.03 45.42,14 v31.4,14
I2C1_SCL
  Top 0.152: MPU9250.3 35.12,59.62 IC3.58
  Bottom 0.152: R18.1 39.84,64.46 | MPU9250.3 33.58,62.68 34.6,63.69 36.03,63.69 36.8,64.46 39.84,64.46 | I2C.2 44,64.46 39.84,64.46
I2C1_SDA
  Top 0.152: IC3.59 34.62,57.58 MPU9250.4 31.04,61.66 32.31,62.93 42.98,62.93 I2C.1
  Bottom 0.152: R19.1 37.39,67.5 MPU9250.4
LI_1
  Top 0.305: Q11.3 10.21,46.2 JP3.1
LI_2  (via drill 0.35)
  Top 0.305: C12.1 17.14,53.09 D2.C v15.04,54.55 13.25,54.55 12.69,55.11 8.89,55.11 JP3.4
  Bottom 0.305: v15.04,54.55 16.09,55.6 Q12.3
N$1  (via drill 0.35)
  Top 0.152: R16.2 59.16,17.97 v40.95,17.97 | U$5.STATUS 35.34,19.23 v34.85,18.74
  Bottom 0.152: v40.95,17.97 35.36,17.97 34.85,18.48 v34.85,18.74
N$2
  Top 0.305: 13.31,21.24 LED1.A 13.2,21.13 R2.1
N$3
  Top 0.152: IC3.36 51.49,33.5 R6.2
N$4
  Top 0.305: 9.09,48.34 Q11.2
  Top 0.61: U$1.P$1 5.17,52.26 9.09,48.34
N$5  (via drill 0.35)
  Top 0.305: R41.2 6.39,10.52 | U$10.P$2 3.74,10.52 v5.4,10.52 6.39,10.52 | C15.1 6.39,10.52 | v57.4,35 56.4,35 55.77,34.37 50.95,34.37 50.58,34 IC3.37 | v48.4,15 38.4,5 v10.4,5
  Bottom 0.305: v57.4,35 60.4,32 60.4,27 v48.4,15 | v10.4,5 5.4,10 v5.4,10.52
N$6  (via drill 0.35)
  Top 0.305: v10.72,17.21 8.69,19.24 v8.69,23.56
  Bottom 0.305: R15.1 R17.2 10.72,16.87 v10.72,17.21 | v8.69,23.56 9.96,24.83 U$2.OV3
N$7
  Top 0.152: R1.1 26.59,38.38 25.2,38.38 Q2.1
  Top 0.305: C10.2 24.95,38.13 25.2,38.38
N$8
  Top 0.152: R6.1 LED3.A
N$9  (via drill 0.35)
  Top 0.305: v9.96,20.51 9.96,19.5 v12.5,16.96
  Bottom 0.305: U$2.UV3 10.59,24.77 9.67,23.85 9.67,23.48 9.24,23.05 9.24,21.62 9.96,20.9 v9.96,20.51 | v12.5,16.96 13.6,15.85 R17.1 R23.2
N$10
  Bottom 0.305: U$2.G3 9.96,29.34 12.32,26.98 15.63,26.98 18.57,24.04 18.57,22.86 19.58,21.85 19.58,20.58 Q4.1 Q1.1
N$11
  Bottom 0.305: R31.2 11.95,22.34 | 11.95,22.34 12.5,22.89 U$2.OV1 | R30.1 10.09,22.34 11.95,22.34
N$12
  Bottom 0.305: U$2.UV1 13.13,22.76 R31.1 R32.2
N$13  (via drill 0.35)
  Top 0.152: U$9.P$3 37.14,66.4 v37.14,63.69 | v32.82,54.3 32.82,52.35 R28.2
  Top 0.305: U$9.P$3 U$9.P$4
  Bottom 0.152: v37.14,63.69 37.14,59.98 36.78,59.63 36.78,56.23 35.61,55.06 33.58,55.06 v32.82,54.3
N$14
  Top 1.27: Q10.2 10.62,68.34 11.89,69.61 17,69.61 U$7.P$2
N$15  (via drill 0.35)
  Top 0.305: v11.63,23.46 11.63,21.13 v12.25,20.51
  Bottom 0.305: U$2.UV2 11.87,23.69 v11.63,23.46 | v12.25,20.51 13.6,19.16 R27.1 R29.2
N$16  (via drill 0.35)
  Top 0.305: v11.23,20.51 10.59,21.15 v10.59,23.37
  Bottom 0.305: R25.1 R27.2 11.9,19.84 v11.23,20.51 | v10.59,23.37 10.59,24.13 11.23,24.76 U$2.OV2
N$17
  Bottom 0.305: C6.1 7.85,33.58 9.25,33.58 10.59,32.24 U$2.VS3 10.72,31.06 10.72,29.46 12.72,27.45 16.11,27.45 19.59,23.97 19.59,23.36 19.97,22.98 22.18,22.98 22.69,22.46 Q4.2 Q1.2
N$18
  Top 0.61: U$6.P$1 3.39,44.42 Q3.2
N$20  (via drill 0.35)
  Top 0.305: R21.1 8.66,60.88 v7.67,59.88
  Bottom 0.305: Q12.2 15.04,53.5 8.66,59.88 v7.67,59.88
  Bottom 1.27: U$7.P$1 22.41,66.74 TRANSISTER2.P$3 22.43,64.48 14.14,64.48 9.55,59.88 v7.67,59.88 7.42,60.14 U$8.P$1
N$21
  Bottom 0.305: C5.1 10.72,32.77 11.23,32.77 11.87,32.14 U$2.VS2 11.87,29.83 13.27,28.43 16.7,28.43 17.75,27.37 21.25,27.37 21.63,27.75 22.62,27.75 23.13,27.25 24.22,27.25 26.5,24.96 Q5.2 Q6.2
N$22
  Bottom 0.305: U$2.G2 11.23,29.59 12.88,27.94 16.53,27.94 Q6.1 Q5.1
N$23
  Bottom 0.305: C4.1 10.21,34.8 13.13,31.88 U$2.VS1 13.13,30.11 13.87,29.38 18.16,29.38 18.82,28.72 19.64,28.72 20.07,29.15 Q9.2 Q7.2
N$24
  Bottom 0.305: U$2.G1 12.5,30.1 13.69,28.91 17.85,28.91 18.56,28.2 Q9.1 20.72,28.33 24.28,28.33 Q7.1
N$27
  Top 0.305: R35.1 6.06,25.25 U$3.6TRIM
N$28
  Bottom 0.305: Q16.2 Q15.2
N$31
  Top 0.305: R36.1 R35.2
N$32
  Top 0.152: TRANSISTER2.P$1 29.52,63.95 29.52,59.34 27.3,57.12 Q8.3
N$35
  Top 0.152: TRANSISTER2.P$4 23.17,69.28 18.6,64.71 R24.1
  Top 0.305: Q10.1 14.19,67.71 15.71,66.19 R24.1
N$36
  Top 0.152: LED5.A 67.98,11.13 R16.1
N$39
  Bottom 0.305: Q17.2 7.15,46.2 6.35,47 6.35,54.23 7.23,55.11 8.99,55.11 JP3.2
N$41
  Top 0.305: LED2.A 8.23,62.94 R21.2
N$42
  Top 0.152: TRANSISTER2.P$2 31.3,69.28 24.86,62.84 24.86,57.09 R22.2
N$43
  Bottom 0.305: R26.1 67.96,62.04 LED7.A
N$45
  Top 0.305: C19.1 39.12,29.17 IC3.31
N$46
  Top 0.305: C8.1 43.62,39 IC3.47
NRST  (via drill 0.35)
  Top 0.152: 24.33,51.29 C27.1 | S1.2 32.29,63.24 30.96,63.24 29.82,62.1 29.82,59.22 28.18,57.58 28.18,55.06 24.56,51.44 C27.1 | IC3.7 30.25,36.62 30.96,36.62 31.4,37.06 v31.4,38.66 | v26.22,47.95 26.22,49.23 24.18,51.26 C27.1
  Top 0.305: S1.2 S1.4
  Bottom 0.152: v31.4,38.66 31.4,42.76 v26.22,47.95
OSC_IN
  Top 0.152: IC3.5 29.42,37.5 29.06,37.86 29.06,39.07 26.53,41.6 24.34,41.6 23.16,42.78 Q2.3 21.29,42.78 C9.2
OSC_OUT
  Top 0.152: R1.2 28.35,38.41 28.35,38.07 29.42,37 IC3.6
PGOOD  (via drill 0.35)
  Top 0.152: IC3.24 35.62,28.21 v36.81,27.01 | v27.4,15 26.89,15 23.57,11.68 8.72,11.68 3,17.4 3,29.44 3.91,30.35 6.45,30.35 6.9,30.8 6.9,36 U$3.10PGOOD
  Top 0.305: U$3.10PGOOD 8.44,38.98 R37.2
  Bottom 0.152: v36.81,27.01 33.21,23.41 32.57,23.41 27.4,18.24 v27.4,15
RESET  (via drill 0.35)
  Top 0.152: IC3.34 49.53,32.5 v52.38,29.66 | U$5.RESET 36.11,21.55 37.1,22.55 v37.14,22.55
  Bottom 0.152: v37.14,22.55 38.66,24.07 48.06,24.07 52.38,28.39 v52.38,29.66
SDDETECT  (via drill 0.35)
  Top 0.152: IC3.62 33.12,43.2 v33.28,43.36 | v39.27,51.18 41.05,52.96 45.7,52.96 R3.2 47.71,54.97 47.71,62.67 v47.84,62.8
  Bottom 0.152: v39.27,51.18 37.29,51.18 33.28,47.17 v33.28,43.36 | v47.84,62.8 49.54,64.5 J1.MP4
  Bottom 0.305: R26.2 52.1,62.17 J1.MP4
SDIO_CK  (via drill 0.35)
  Top 0.152: v54.41,50.74 53.14,49.47 41.71,49.47 41.55,49.31 arc90 41.55,48.94 41.61,48.88 arc-90 41.61,48.5 41.55,48.44 arc-90 41.17,48.44 40.68,48.93 arc90 40.31,48.93 40.25,48.87 arc90 40.25,48.49 40.73,48.01 arc-90 40.73,47.63 40.67,47.57 arc-90 40.3,47.57 39.81,48.06 arc90 39.43,48.06 39.37,48 arc90 39.37,47.62 39.86,47.13 arc-90 39.86,46.76 39.8,46.7 arc-90 39.42,46.7 38.94,47.18 arc90 38.56,47.18 38.5,47.12 arc90 38.5,46.75 38.99,46.26 arc-90 38.99,45.88 38.93,45.82 arc-90 38.55,45.82 38.49,45.88 arc90 38.12,45.88 37.62,45.38 IC3.53
  Bottom 0.152: J1.5 54.98,53.28 54.98,51.31 v54.41,50.74
SDIO_CMD  (via drill 0.35)
  Top 0.152: v56.95,52.01 56.29,51.35 54.16,51.35 52.59,49.78 40.31,49.78 37.12,46.58 IC3.54
  Bottom 0.152: J1.3 57.18,53.28 | 57.18,53.28 57.18,52.23 v56.95,52.01 | R12.2 57.61,46.92 57.61,52.84 57.18,53.28
SDIO_D0  (via drill 0.35)
  Top 0.152: v51.87,35.5 51.37,35 49.52,35 arc90 49.25,34.74 arc-90 48.99,34.47 48.87,34.47 arc-90 48.6,34.74 48.6,35.27 arc90 48.33,35.54 48.21,35.54 arc90 47.94,35.27 47.94,34.74 arc-90 47.68,34.47 47.56,34.47 arc-90 47.29,34.74 47.29,35.27 arc90 47.02,35.54 46.9,35.54 arc90 46.63,35.27 46.63,34.74 arc-90 46.37,34.47 46.25,34.47 arc-90 45.98,34.74 45.98,35.27 arc90 45.71,35.54 45.59,35.54 arc90 45.33,35.27 45.33,34.74 arc-90 45.06,34.47 44.94,34.47 arc-90 44.67,34.74 44.67,35.27 arc90 44.4,35.54 44.28,35.54 arc90 44.02,35.27 44.02,34.74 arc-90 43.75,34.47 43.63,34.47 arc-90 43.36,34.74 arc90 43.1,35 IC3.39
  Bottom 0.152: J1.7 52.77,45.5 | 52.77,45.5 52.77,36.41 v51.87,35.5 | 52.77,45.5 53.77,45.5 R10.2
SDIO_D1  (via drill 0.35)
  Top 0.152: IC3.40 42.6,35.5 43.11,36.01 44.5,36.01 arc90 44.77,36.28 44.77,36.88 arc-90 45.04,37.15 49.05,37.15 arc-90 49.32,36.88 49.32,36.28 arc90 49.58,36.01 v50.85,36.01
  Bottom 0.152: J1.8 51.68,53.28 | 51.68,53.28 51.68,36.83 v50.85,36.01 | R11.2 50.73,52.33 51.68,53.28
SDIO_D2  (via drill 0.35)
  Top 0.152: v59.36,52.14 59.36,49.72 58.5,48.86 44.25,48.86 38.62,43.23 IC3.51
  Bottom 0.152: J1.1 59.37,53.28 | 59.37,53.28 59.37,52.15 v59.36,52.14 | R14.2 60.76,51.89 59.37,53.28
SDIO_D3  (via drill 0.35)
  Top 0.152: v58.22,50.74 56.65,49.17 42.98,49.17 39.96,46.14 arc90 39.96,45.77 40.04,45.68 arc-90 40.04,45.31 39.72,44.99 arc-90 39.34,44.99 39.26,45.07 arc90 38.88,45.07 38.12,44.3 IC3.52
  Bottom 0.152: J1.2 58.22,53.94 58.22,53.28 | 58.22,53.28 v58.22,50.74 | R13.2 58.73,45.75 58.73,52.77 58.22,53.28
SIGNAL_0  (via drill 0.35)
  Top 0.152: v30.03,53.53 28.47,53.53 Q8.2 | IC3.57 35.62,50.49 35.99,50.87 v35.99,52.9
  Bottom 0.152: v30.03,53.53 35.36,53.53 v35.99,52.9
SPI1_MISO
  Top 0.152: IC3.22 34.62,27.9 42.56,19.95 68.4,19.95 JP4.8
SPI1_MOSI
  Top 0.152: IC3.23 35.12,27.83 42.69,20.26 68.07,20.26 68.43,20.61 68.43,22.52 JP4.6
SPI1_NSS
  Top 0.152: IC3.20 33.62,28.03 42.31,19.35 64.51,19.35 66.42,17.44 68.47,17.44 JP4.12
SPI1_SCK
  Top 0.152: IC3.21 34.12,27.97 42.43,19.65 64.66,19.65 66.57,17.74 68.73,17.74 JP4.10
SWCLK
  Top 0.152: IC3.49 39.65,41.53 39.65,43.28 44.88,48.52 66.87,48.52 JP2.2
SWDIO  (via drill 0.35)
  Top 0.152: IC3.46 41.71,38.52 48.06,38.52 49.33,39.79 60.41,39.79 63.87,43.25 63.87,45.47 v65.14,46.74
  Bottom 0.152: JP2.1 67.63,46.74 v65.14,46.74
SWO  (via drill 0.35)
  Top 0.152: IC3.55 36.62,46.92 40.19,50.49 51.87,50.49 58.47,57.09 v65.59,57.09
  Bottom 0.152: JP2.5 66.79,57.6 66.5,57.24 66.35,57.09 v65.59,57.09
USART2_RX
  Top 0.152: IC3.17 32.12,27.31 31.84,27.03 31.84,19.46 33.67,17.63 U$5.TXD
USART2_TX
  Top 0.152: IC3.16 31.54,30.6 31.54,19.33 36.04,14.83 38.87,14.83 40.02,15.98 40.02,16.9 39.69,17.23 U$5.RXD
USART3_RX
  Top 0.152: IC3.30 38.62,27.92 42.72,23.82 JP4.5
USART3_TX
  Top 0.152: IC3.29 38.12,27.99 44.83,21.28 JP4.7
USART4_RX
  Top 0.152: IC3.15 29.42,32.5 29.11,32.2 29.11,27.09 21.66,19.63 U$4.P$5
USART4_TX
  Top 0.152: IC3.14 29.42,33 28.81,32.39 28.81,27.21 21.26,19.66 U$4.P$3
USB_OTG_FS_DM
  Top 0.152: J2.2 64.39,39.27 62.62,37.5 IC3.44
USB_OTG_FS_DP
  Top 0.152: J2.3 64.36,40.07 62.29,38 49.96,38 | IC3.45 49.96,38 | R8.1 49.93,38.04 49.96,38
V0  (via drill 0.35)
  Top 0.305: U$3.2VIN2 16.9,36.67 16.38,37.18 15.9,37.18 U$3.2VIN1 14.97,38.11 C17.1 | C17.1 14.12,39.22 v14.12,38.75 | C17.1 13.01,42.04 v13.01,42.72
  Bottom 0.305: v14.12,38.75 13.55,39.32 Q15.3 | v13.01,42.72 12.33,43.39 D3.C
V1  (via drill 0.35)
  Top 0.305: v17.83,23.56 17.83,26.71 18.27,27.15 18.27,29.33 19.36,30.42 v19.36,31.18 | v17.59,36.77 17.59,37.79 16.72,38.66 16.72,40.16 13.48,43.4 | 13.48,43.4 12.73,43.4 11.65,42.32 Q3.3 | 13.48,43.4 17.52,47.44 22.41,47.44 23.42,46.42 25.96,46.42 29.94,50.4 R4.1
  Bottom 0.305: Q7.3 22.56,31.94 20.12,31.94 v19.36,31.18 U$2.V1 15.04,34.04 C3.1 16.31,35.38 17.59,36.66 v17.59,36.77 | R32.1 17.16,22.89 v17.83,23.56
V2  (via drill 0.35)
  Top 0.305: v23.42,25.85 21.64,25.85 20.63,26.86 v20.63,31.18 | v18.85,21.28 18.85,25.85 v19.36,26.36 | v13.17,38.4 13.88,37.68 13.88,33.4 v13.83,33.34
  Bottom 0.305: 14.41,32.45 U$2.V2 14.41,30.6 14.72,30.29 19.48,30.29 20.37,31.18 v20.63,31.18 | 14.41,32.45 14.41,35.19 C2.1 13.83,34.87 v13.83,33.34 13.83,33.03 14.41,32.45 | Q5.3 24.34,25.85 v23.42,25.85 22.84,26.44 22.84,26.89 22.43,27.29 21.82,27.29 21.14,26.61 19.61,26.61 v19.36,26.36 | v18.85,21.28 18.85,20.43 17.41,18.99 R29.1 | v13.17,38.4 12.94,38.17 11.11,38.17 9.34,39.94 7.51,39.94 6.22,41.23 Q17.3
V3  (via drill 0.35)
  Top 0.305: v19.36,29.4 20.17,28.59 20.17,26.67 21.45,25.39 22.29,25.39 23.17,24.52 v23.17,23.05 23.17,22.11 18.6,17.54 v18.6,15.94 | v12.93,33.84 12.03,34.74 v12.03,38.89
  Bottom 0.305: 12.93,32.85 13.77,32.01 U$2.V3 13.89,31.06 13.89,30.47 14.53,29.84 18.93,29.84 v19.36,29.4 | 12.93,32.85 12.25,33.53 C1.1 | v23.17,23.05 24.4,21.82 Q1.3 | R23.1 18.34,15.69 v18.6,15.94 | v12.03,38.89 11.78,39.14 11.2,39.14 9.96,40.38 9.96,51.5 JP3.3 | v12.93,33.84 12.93,32.85
V_LOAD  (via drill 0.35)
  Top 0.305: v21.64,22.04 v21.64,24.56 | v21.64,29.91 22.15,29.4 v22.15,26.61 | v21.64,31.26 20.88,32.02 v20.88,32.71 14.09,32.71 13.67,32.28 v9.59,32.28 | v20.6,20.52 20.6,20.19 17.91,17.5 17.91,12.83 v18.46,12.28
  Bottom 0.305: v21.64,22.04 21.64,21.78 21.32,21.46 Q4.3 v20.59,20.53 v20.6,20.52 | v21.64,24.56 20.59,25.62 Q6.3 21.32,25.78 v22.15,26.61 | Q9.3 21.46,30.1 v21.64,29.91 v21.64,31.26 | v20.88,32.71 18.34,35.25 18.34,38.9 Q16.3 | v18.46,12.28 18.46,12.18 19.34,11.3 C11.1 17.14,11.3 D1.C | U$2.VOUT 9.32,32.02 v9.59,32.28
VALID1  (via drill 0.35)
  Top 0.152: v19.5,16 20.89,17.39 25.03,17.39 25.31,17.11 27.51,17.11 v28.4,18 | v37.5,26.41 37.5,27.25 36.12,28.63 IC3.25
  Bottom 0.152: U$2.VALID1 9.32,25.05 5.29,21.02 5.29,18.48 5.4,18.37 5.4,16.22 6.71,14.91 18.42,14.91 19.2,15.69 19.2,15.7 v19.5,16 | v28.4,18 30.33,19.93 31.42,19.93 37.5,26.01 v37.5,26.41
  Bottom 0.305: U$2.VALID1 9.2,26.22 9.2,26.81 6.24,29.78 R40.2
VALID2  (via drill 0.35)
  Top 0.152: IC3.26 36.62,28.6 38.31,26.91 38.31,25.88 v38.16,25.72 | v29.47,18.13 28.15,16.81 25.18,16.81 24.99,17 20.96,17 20.12,16.16 20.12,15.75 v19.46,15.09
  Bottom 0.152: v19.46,15.09 19.03,15.09 18.55,14.6 6.5,14.6 4.98,16.12 4.98,21.15 8.69,24.85 U$2.VALID2 | v38.16,25.72 31.78,19.35 30.66,19.35 29.47,18.16 v29.47,18.13
  Bottom 0.305: U$2.VALID2 8.57,26.22 8.57,26.8 7.23,28.13 R39.2
VALID3  (via drill 0.35)
  Top 0.152: v19.03,14.23 19.29,14.48 19.71,14.48 20.07,14.84 20.07,15.27 20.53,15.73 20.53,16.13 20.91,16.5 28.7,16.5 30.83,18.63 v30.94,18.63 | v38.89,25.14 39.02,25.26 39.02,26.64 37.12,28.54 IC3.27
  Bottom 0.152: U$2.VALID3 8.05,25.66 4.68,22.28 4.68,16 6.38,14.3 18.97,14.3 v19.03,14.23 | v38.89,25.14 32.39,18.63 v30.94,18.63
  Bottom 0.305: U$2.VALID3 R9.2
VCC  (via drill 0.35)
  Top 0.305: J2.1 62.86,36.01 | 62.86,36.01 57.54,30.7 v57.18,30.7 | R8.2 55.14,40.61 v55.17,40.58 | v61.78,36.01 62.86,36.01
  Bottom 0.305: D3.A 14.35,43.79 R33.1 15.04,43.27 Q15.1 Q16.1 18.85,40.29 18.85,35.75 22.2,32.4 24.53,32.4 29.05,27.88 48.62,27.88 51.43,30.7 v57.18,30.7 | v55.17,40.58 59.74,36.01 v61.78,36.01
VDD  (via drill 0.35)
  Top 0.254: U$4.P$14 23.26,14.26 | U$4.P$16 23.66,14.66 | v28.4,13.28 22.45,7.33 5.53,7.33 2.17,10.69 2.17,12.65 U$10.P$1
  Top 0.305: 29.01,44.2 C25.1 30.13,43.34 | C22.1 40.48,29.15 IC3.32 39.65,30.1 39.65,31.05 38.3,32.4 | v60.76,41.85 v58.47,41.85 v56.19,41.85 v53.9,41.85 v50.73,41.85 49.33,41.85 46.11,45.07 44.86,45.07 44.2,44.42 44.2,43.39 C23.1 42.98,40.88 IC3.48 41.55,39.47 40.6,39.47 39.77,38.64 39.77,38.55 | 38.3,32.4 38.22,32.48 34.73,32.48 34.01,31.77 | 34.01,31.77 33.14,30.9 33.14,30.1 IC3.19 33.12,29.2 32.82,28.9 C21.1 34.34,24.77 34.34,20.01 34.72,19.63 U$5.VCC | 39.77,38.55 39.77,33.88 38.3,32.4 | 39.77,38.55 32.47,38.55 31.55,39.47 30.28,39.47 IC3.1 30.13,43.12 | 34.01,31.77 32.28,33.5 IC3.13 29.11,33.5 28.61,33 26.83,33 | C26.2 25.71,31.88 26.83,33 | C20.2 27.74,32.08 26.83,33 | IC3.64 31.8,41.49 | 31.8,41.49 31.72,41.49 | v48.82,56.07 48.82,66.23 46.79,68.27 v45.52,68.27 43.09,65.84 U$9.P$2 | 14.9,20.31 14.9,22.03 C13.1 15.31,22.44 U$3.4VOUT 15.06,25.33 U$3.5SENSE 9.45,26.61 9.45,27.63 8.94,28.13 3.86,28.13 v3.61,27.88 | 14.9,20.31 R38.1 | 14.9,20.31 R2.2 15.04,18.23 v16.06,17.21 | JP4.1 JP4.2 | U$9.P$2 U$9.P$1 | U$9.P$2 41.96,64.13 v41.96,63.69 | v23.17,14.16 23.26,14.26 23.66,14.66 | JP2.3 66.3,52.52 64.52,54.3 v64.52,55.82 | v5.13,39.06 5.9,39.82 R37.1 | 30.13,43.34 30.13,43.12 | 30.13,43.34 31.04,44.25 C24.1 | 31.8,41.49 30.18,43.12 30.13,43.12
  Bottom 0.305: R10.1 53.93,43.91 53.9,43.88 v53.9,41.85 | 56.16,50.58 C14.1 56.07,50.79 | 50.76,54.55 50.76,54.07 50.73,54.04 J1.MP2 | 50.76,54.55 52.82,56.61 54.09,56.61 56.07,54.63 J1.4 | 50.76,54.55 50.43,54.22 48.82,55.82 v48.82,56.07 47.04,57.85 I2C.4 | R19.2 R18.2 45.35,68.27 v45.52,68.27 | 56.07,50.79 J1.4 | v41.96,63.69 39.42,61.15 MPU9250.1 | R14.1 v60.76,41.85 67.18,35.43 JP4.1 51.56,13.28 v28.4,13.28 24.05,13.28 v23.17,14.16 22.86,14.16 20.15,16.88 16.39,16.88 v16.06,17.21 | v58.47,41.85 R13.1 | v56.19,41.85 R12.1 55.13,44.85 55.13,49.55 56.07,50.49 56.07,50.79 | v50.73,41.85 R11.1 | J1.4 56.07,54.28 58.55,56.76 63.58,56.76 v64.52,55.82 | v5.13,39.06 4.54,38.46 R40.1 R39.1 R9.1 4.54,26.95 v3.61,27.88
(copper drawn outside any net)
  shapes: Top area x3

### Text on the board
tPlace: GND / CLK / DIO / VDD
bNames: VDD / GND / SCL / SDA | p | p | p | VDD / GND / RX / TX | VDD / GND / MOSI / MISO / SCK / NSS
tDocu: +
bDocu: +